# EasyEDA Pro project ProProject_ESP32-CAN_2024-07-06.epro

# Schematic can
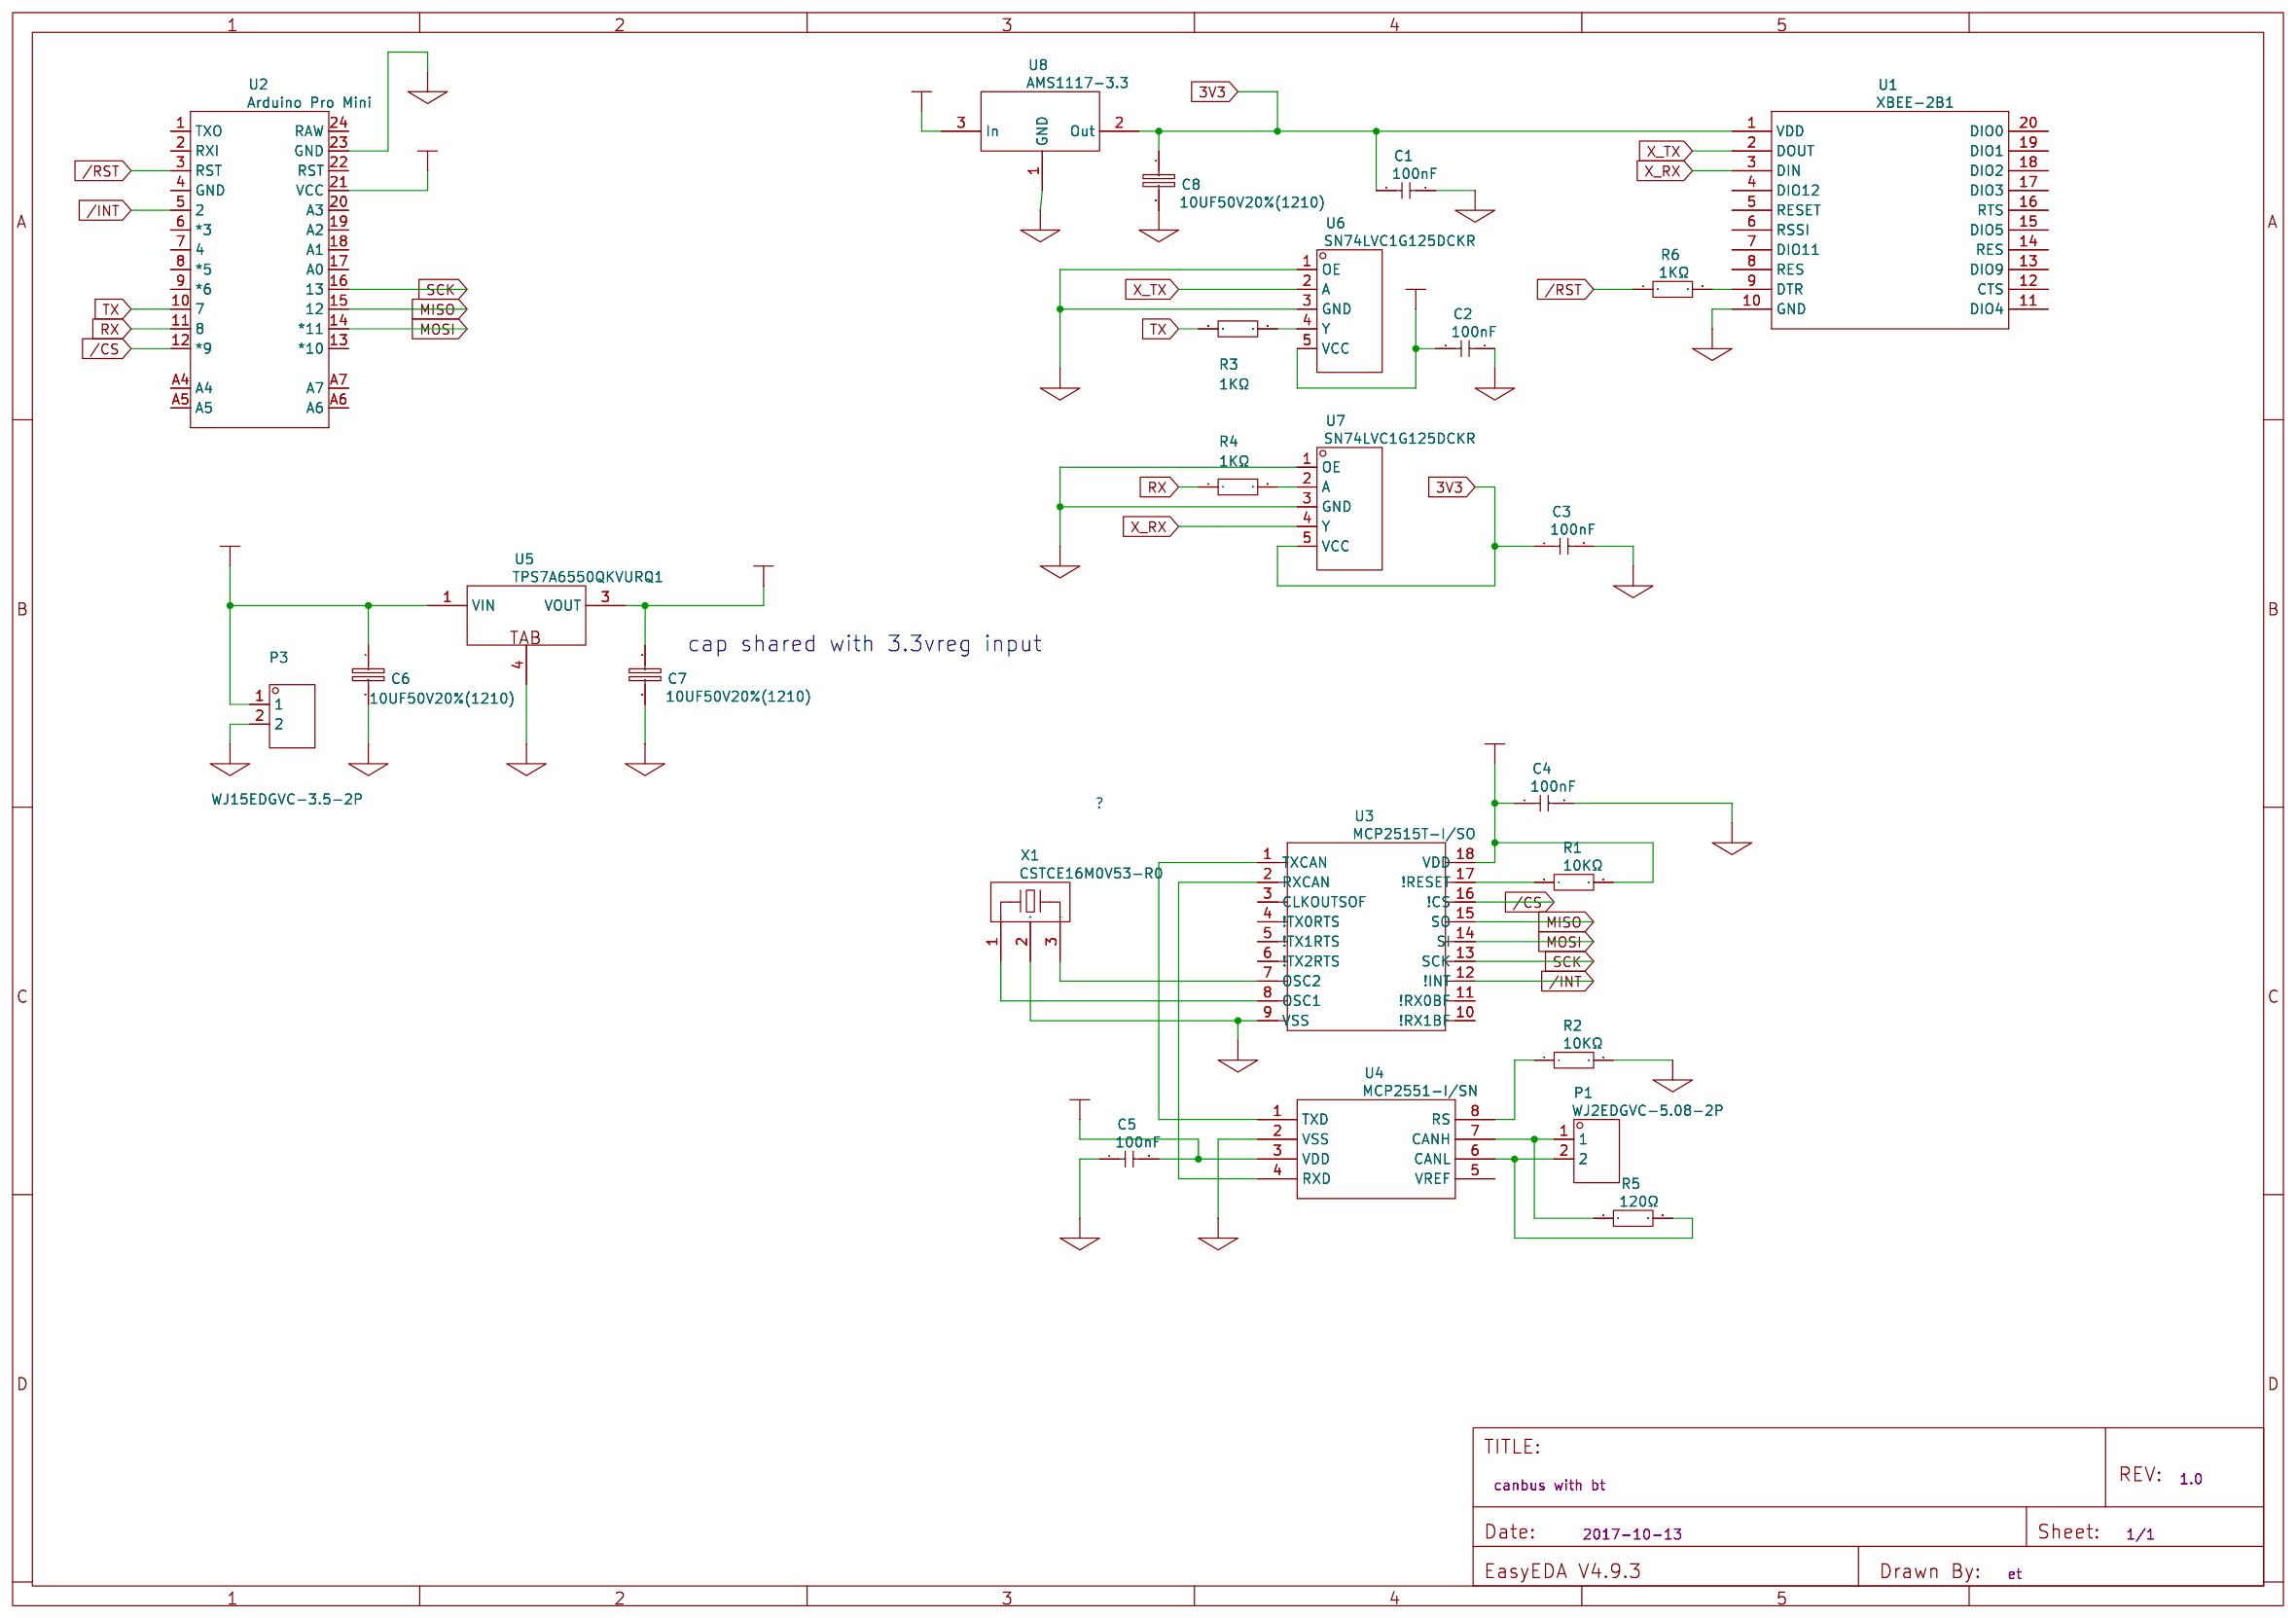
[diagram p0: schematic sheet]

## Parts
C1  100nF
C2  100nF
C3  100nF
C4  100nF
C5  100nF
C6  10UF50V20%(1210)
C7  10UF50V20%(1210)
C8  10UF50V20%(1210)
P1  WJ2EDGVC-5.08-2P
P3  WJ15EDGVC-3.5-2P
R1  10KΩ
R2  10KΩ
R3  1KΩ
R4  1KΩ
R5  120Ω
R6  1KΩ
U1  XBEE-2B1
U2  Arduino Pro Mini
U3  MCP2515T-I/SO
U4  MCP2551-I/SN
U5  TPS7A6550QKVURQ1
U6  SN74LVC1G125DCKR
U7  SN74LVC1G125DCKR
U8  AMS1117-3.3
X1  CSTCE16M0V53-R0

## Library data of the parts
C1-C5 = 100nF: SMD CAP Ceramic 100nF-50V-10%-X7R; Manufacturer Part: CC0603KRX7R9BB104
C6-C8 = 10UF50V20%(1210): Manufacturer Part: ?
P1 = WJ2EDGVC-5.08-2P: Supplier: LCSC; Manufacturer: ReliaPro; Supplier Part: C8445
P3 = WJ15EDGVC-3.5-2P: Supplier: LCSC; Manufacturer: ReliaPro; Manufacturer Part: WJ15EDGVC-3.5MM-2Pneedle; Supplier Part: C42700
R1 R2 = 10KΩ: Power: 1/10W; Tolerance: ±5%; Supplier: LCSC; Manufacturer: UniOhm; Manufacturer Part: 0603WAJ0103T5E; Supplier Part: C15401
R3 R4 R6 = 1KΩ: Power: 1/10W; Tolerance: ±0.1%; Supplier: LCSC; Manufacturer Part: TC0325B1001T5E; Manufacturer: UniOhm; Supplier Part: C54019
R5 = 120Ω: Power: 1/10W; Tolerance: ±1%; Supplier: LCSC; Manufacturer: UniOhm; Manufacturer Part: 0603WAF1200T5E; Supplier Part: C22787
U1 = XBEE-2B1: Xbee module footprints; Manufacturer Part: ?
U2 = Arduino Pro Mini: Manufacturer Part: ?
U3 = MCP2515T-I/SO: SMD IC Interface;
U4 = MCP2551-I/SN: SMD IC Interface
U5 = TPS7A6550QKVURQ1: Single Output Automotive LDO, 300 mA, Fixed 5 V Output, 4 to 40 V Input, 3-pin PFM (KVU), -40 to 125 degC, Green (RoHS  no SbBr); Manufacturer Part: ?
U6 U7 = SN74LVC1G125DCKR: Supplier: LCSC; Manufacturer: TI; Supplier Part: C7833
U8 = AMS1117-3.3: Supplier: LCSC; Manufacturer: AMS; Supplier Part: C6186
X1 = CSTCE16M0V53-R0: Supplier: LCSC; Manufacturer: muRata; Supplier Part: C32180

## Nets
3V3: C1.1 C3.1 C8.1 U1.1(VDD) U7.5(VCC) U8.2(Out)
+5V: C2.1 C4.1 C5.2 C7.1 R1.2 U2.21(VCC) U3.18(VDD) U4.3(VDD) U5.3(VOUT) U6.5(VCC) U8.3(In)
GND: C1.2 C2.2 C3.2 C4.2 C5.1 C6.2 C7.2 C8.2 P3.2 R2.2 U1.10(GND) U2.23(GND) U3.9(VSS) U4.2(VSS) U5.4(TAB) U6.1(OE) U6.3(GND) U7.1(OE) U7.3(GND) U8.1(GND) X1.2
VCC: C6.1 P3.1 U5.1(VIN)
/CS: U2.12(*9) U3.16(!CS)
/INT: U2.5(2) U3.12(!INT)
/RST: R6.1 U2.3(RST)
MISO: U2.15(12) U3.15(SO)
MOSI: U2.14(*11) U3.14(SI)
RX: R4.1 U2.11(8)
SCK: U2.16(13) U3.13(SCK)
TX: R3.1 U2.10(7)
X_RX: U1.3(DIN) U7.4(Y)
X_TX: U1.2(DOUT) U6.2(A)
Net-(P1-1): P1.1 R5.1 U4.7(CANH)
Net-(P1-2): P1.2 R5.2 U4.6(CANL)
Net-(R1-1): R1.1 U3.17(!RESET)
Net-(R2-1): R2.1 U4.8(RS)
Net-(R3-2): R3.2 U6.4(Y)
Net-(R4-2): R4.2 U7.2(A)
Net-(R6-2): R6.2 U1.9(DTR)
Net-(U3-1): U3.1(TXCAN) U4.1(TXD)
Net-(U3-2): U3.2(RXCAN) U4.4(RXD)
Net-(U3-7): U3.7(OSC2) X1.3
Net-(U3-8): U3.8(OSC1) X1.1

Not connected (* = marked no-connect by the designer): U1 4(DIO12) 5(RESET) 6(RSSI) 7(DIO11) 8(RES) 11(DIO4) 12(CTS) 13(DIO9) 14(RES) 15(DIO5) 16(RTS) 17(DIO3) 18(DIO2) 19(DIO1) 20(DIO0); U2 1(TXO) 2(RXI) 4(GND) 6(*3) 7(4) 8(*5) 9(*6) 13(*10) 17(A0) 18(A1) 19(A2) 20(A3) 22(RST) 24(RAW) A4 A5 A6 A7; U3 3(CLKOUTSOF) 4(!TX0RTS) 5(!TX1RTS) 6(!TX2RTS) 10(!RX1BF) 11(!RX0BF); U4 5(VREF)

## Notes on the sheet
- cap shared with 3.3vreg input

# Schematic esp32 devkit v1 shield
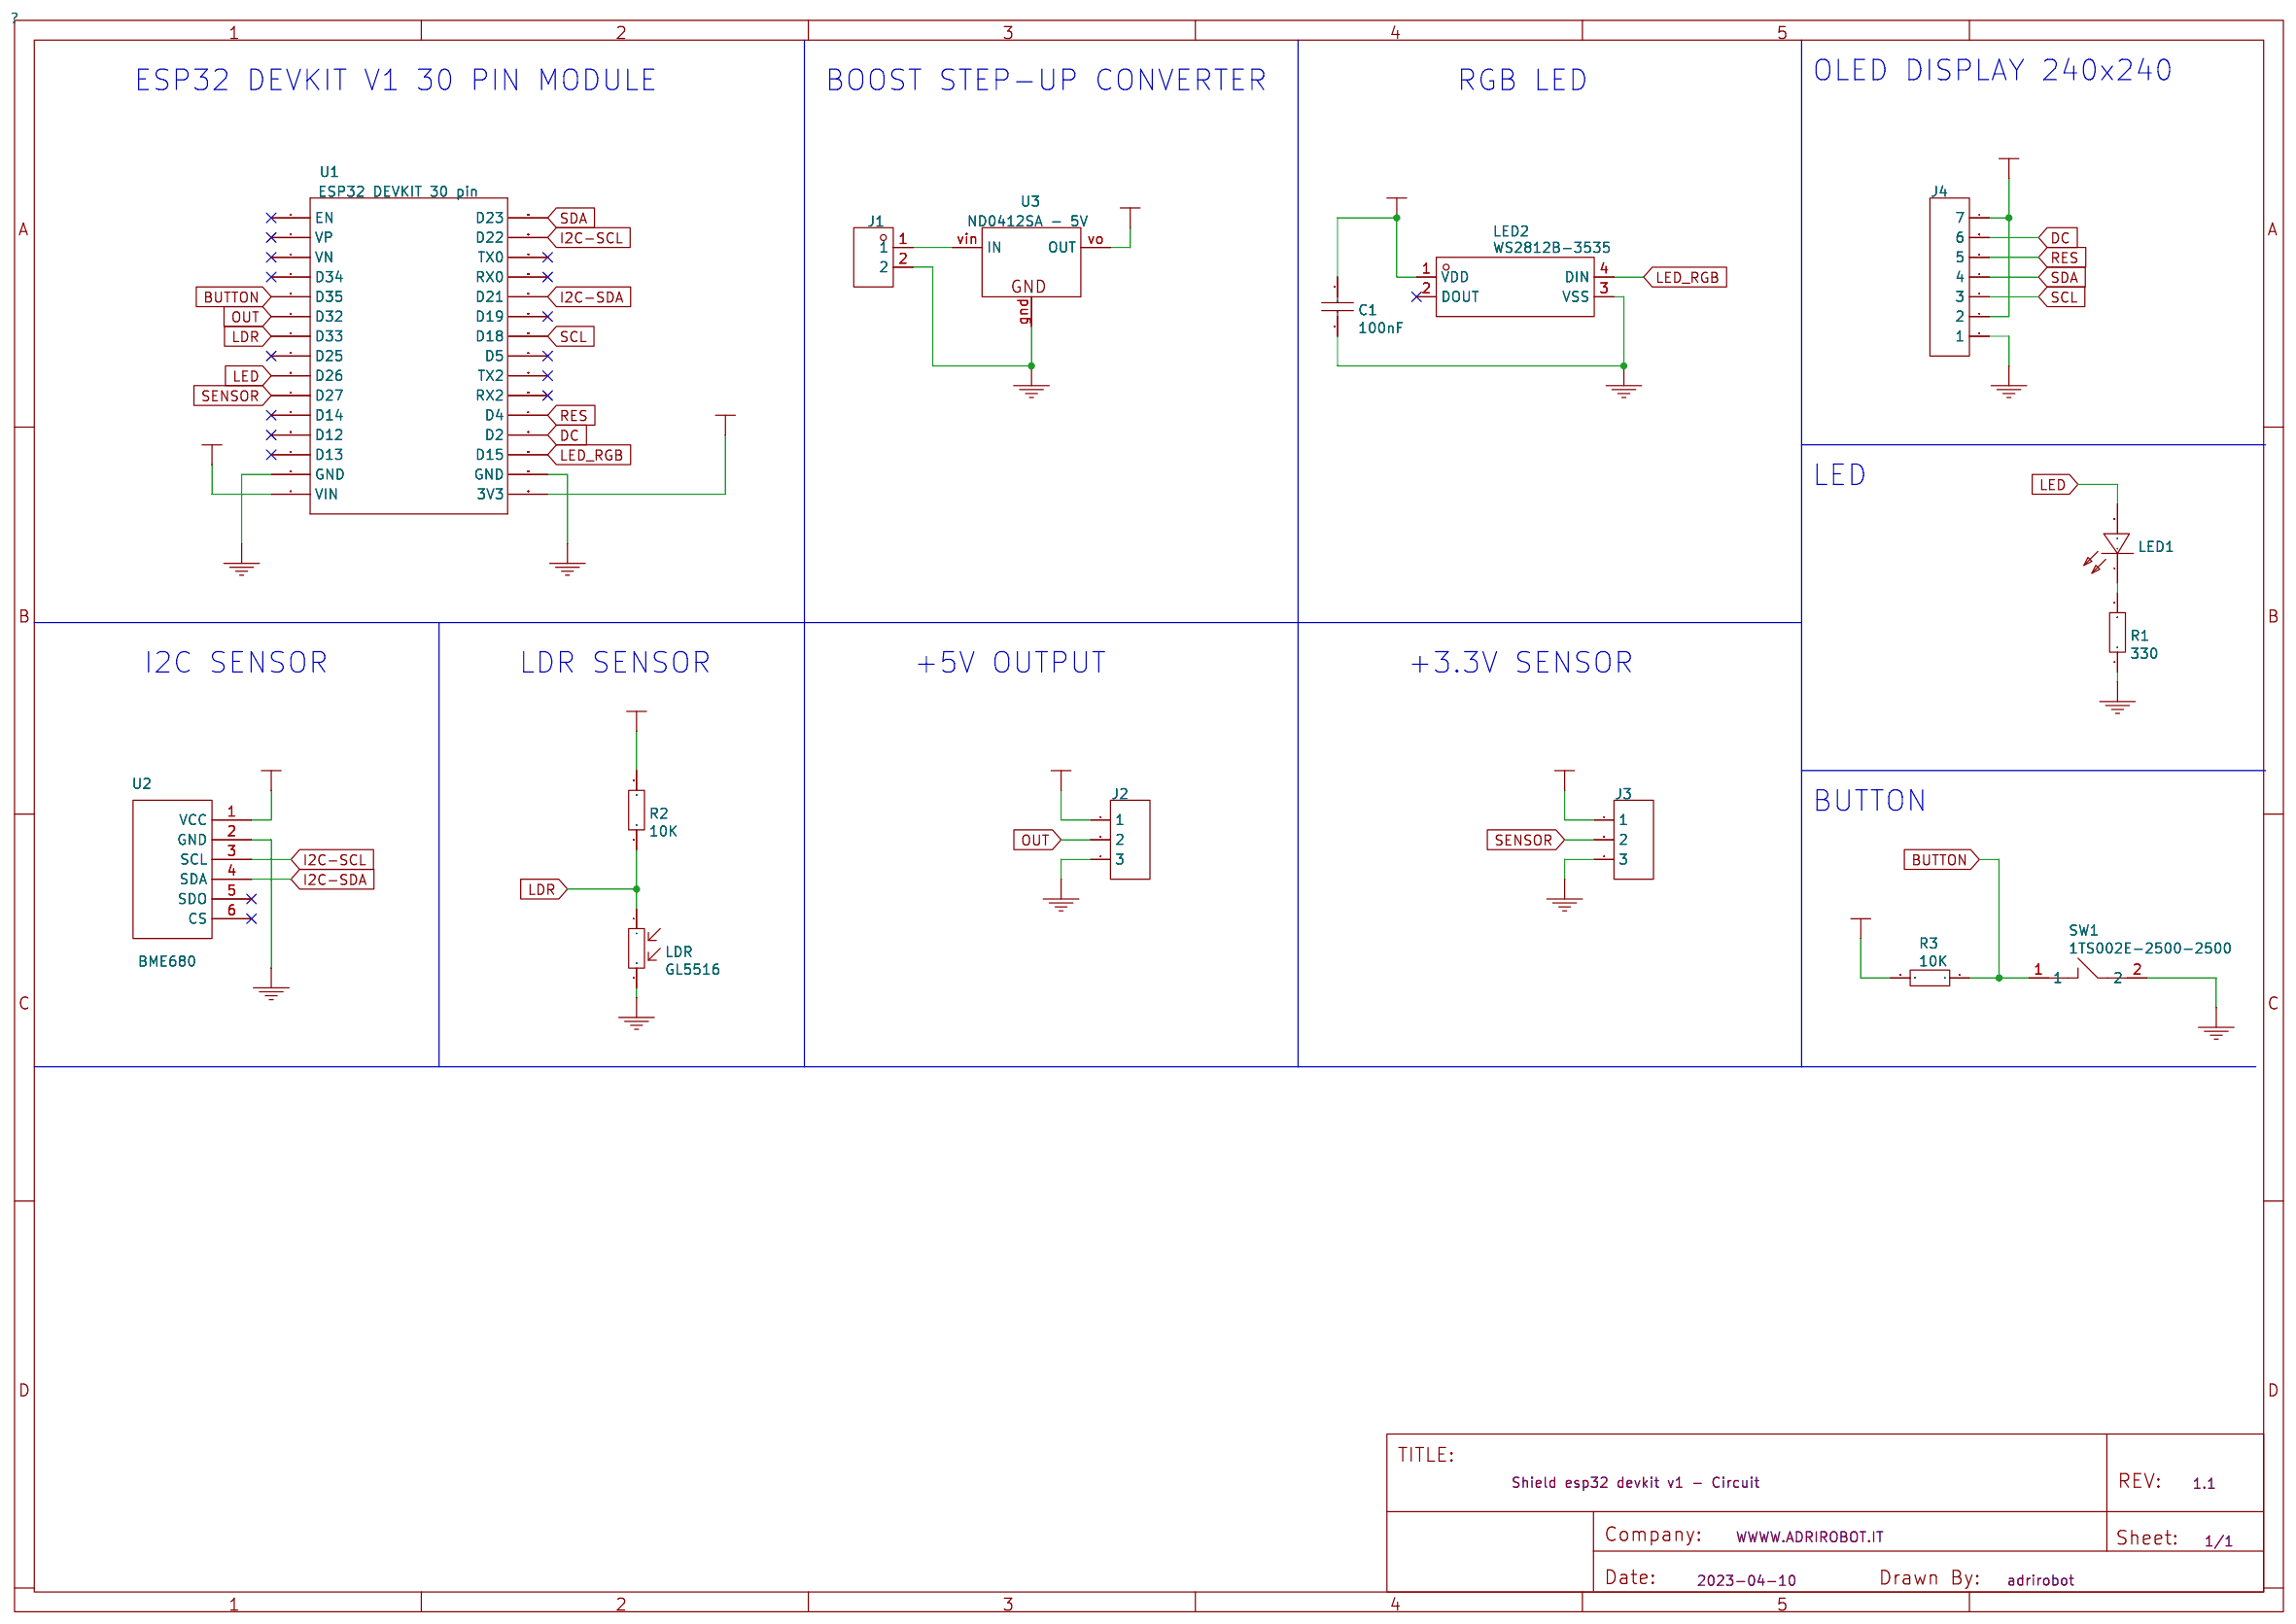
[diagram p1: schematic sheet]

## Parts
C1  100nF
J1  MTB125-1102R1
J2  Header-Female-2.54_1x3
J3  Header-Female-2.54_1x3
J4  CONN_01X07
LDR  GL5516
LED1  XL-0805QBC
LED2  WS2812B-3535
R1  330
R2  10K
R3  10K
SW1  1TS002E-2500-2500
U1  ESP32 DEVKIT 30 pin
U2  BME680
U3  ND0412SA - 5V

## Library data of the parts
C1 = 100nF: Supplier: LCSC; Manufacturer Part: CL21B104JBCNNNC; Manufacturer: SAMSUNG; Supplier Part: C62912; JLCPCB Part Class: Basic; JLCPCB SMD: Yes
J1 = MTB125-1102R1: Supplier: LCSC; Supplier Part: C376120; Manufacturer: MINTRON; JLCPCB Part Class: Extended Part
J2 J3 = Header-Female-2.54_1x3: Supplier Part: C225500; Supplier: LCSC; Manufacturer: Changjiang Connectors; Manufacturer Part: A2541HWV-3P; link: https://datasheet.lcsc.com/szlcsc/Boom-Precision-Elec-2-54mm-1-8P-Straight-Female-header_C27438.pdf; JLCPCB Part Class: Extended Part
J4 = CONN_01X07
LDR = GL5516: Supplier: LCSC; Manufacturer: 森霸; Supplier Part: C125626; JLCPCB Part Class: Extended Part
LED1 = XL-0805QBC: Supplier: LCSC; Manufacturer: EVERLIGHT; Manufacturer Part: 17-21SURC/S530-A3/TR8; Supplier Part: C72037; JLCPCB Part Class: Basic; JLCPCB SMD: Yes
LED2 = WS2812B-3535: Supplier: LCSC; Manufacturer: Worldsemi; Supplier Part: C114583; JLCPCB Part Class: Extend; JLCPCB SMD: Yes
R1 = 330: Supplier: LCSC; Supplier Part: C17630; Manufacturer: UniOhm; Manufacturer Part: 0805W8F3300T5E; JLCPCB Part Class: Extend; JLCPCB SMD: Yes
R2 R3 = 10K: Supplier: LCSC; Supplier Part: C17414; Manufacturer: UniOhm; Manufacturer Part: 0805W8F1002T5E; JLCPCB Part Class: Extend; JLCPCB SMD: Yes
SW1 = 1TS002E-2500-2500: Supplier: LCSC; Supplier Part: C329185; Manufacturer: HYP; JLCPCB Part Class: Extended Part
U1 = ESP32 DEVKIT 30 pin
U2 = BME680: Manufacturer Part: New SchematicLib
U3 = ND0412SA - 5V: Supplier Part: ND0412SA; Supplier: Pololu

## Nets
+3V3: J3.1 J4.2 J4.7 R2.2 R3.2 U1.3V3 U2.1(VCC)
+5V: C1.2 J2.1 LED2.1(VDD) U1.VIN U3.vo(OUT)
GND: C1.1 J1.2 J2.3 J3.3 J4.1 LDR.2 LED2.3(VSS) R1.1 SW1.2 U1.GND@1(GND) U1.GND@2(GND) U2.2(GND) U3.gnd(GND)
BUTTON: R3.1 SW1.1 U1.D35
DC: J4.6 U1.D2
I2C-SCL: U1.D22 U2.3(SCL)
I2C-SDA: U1.D21 U2.4(SDA)
LDR: LDR.1 R2.1 U1.D33
LED: LED1.2(A) U1.D26
LED_RGB: LED2.4(DIN) U1.D15
OUT: J2.2 U1.D32
RES: J4.5 U1.D4
SCL: J4.3 U1.D18
SDA: J4.4 U1.D23
SENSOR: J3.2 U1.D27
Net-(J1-1): J1.1 U3.vin(IN)
Net-(LED1-1): LED1.1(K) R1.2

Not connected (* = marked no-connect by the designer): LED2 2(DOUT)*; U1 D5* D12* D13* D14* D19* D25* D34* EN* RX0* RX2* TX0* TX2* VN* VP*; U2 5(SDO)* 6(CS)*

## Notes on the sheet
- ESP32 DEVKIT V1 30 PIN MODULE
- BOOST STEP-UP CONVERTER
- RGB LED
- OLED DISPLAY 240x240
- LED
- I2C SENSOR
- LDR SENSOR
- +5V OUTPUT
- +3.3V SENSOR
- BUTTON

# Schematic kd8116 v1
Create Date: 2024-02-29; Page Name: P1; Project Name: P1; Schematic Name: Schematic1; Update Date: 2024-02-29; Company: EasyEDA.com; Drawn: EasyEDA; Page Size: A4; Part Number: JLCPCB-002; Reviewed: EasyEDA; Version: V0.1
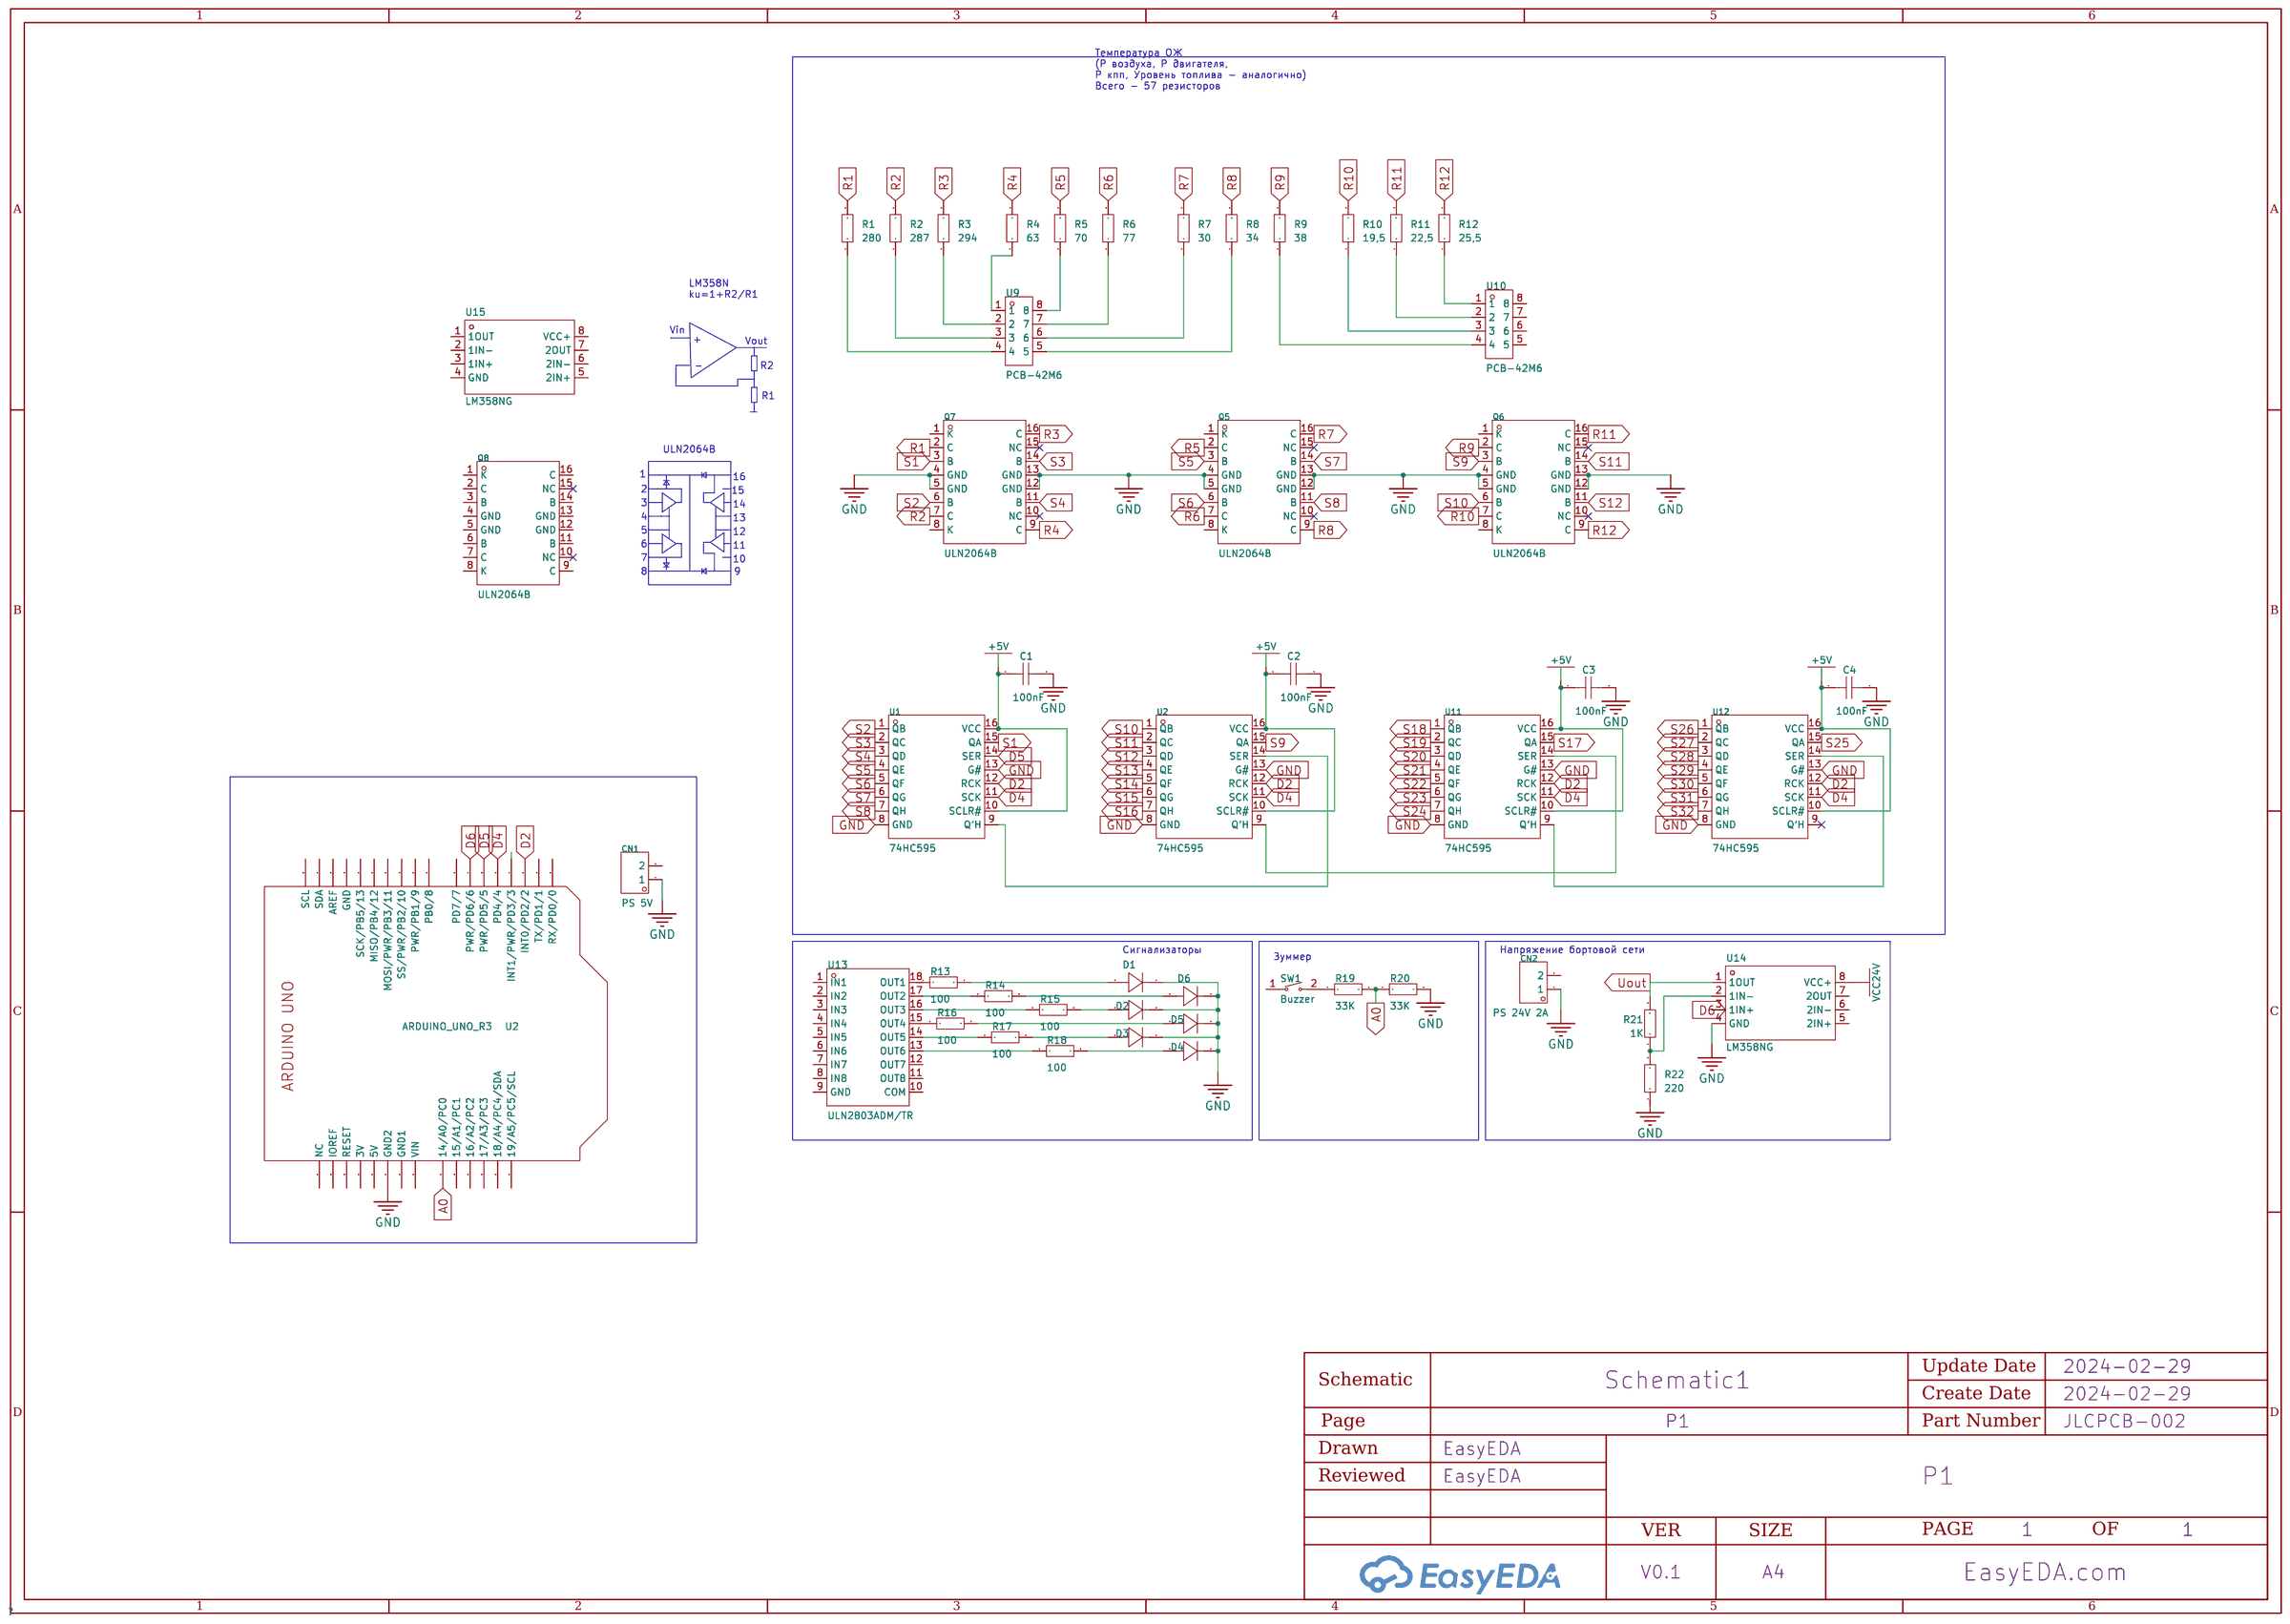
[diagram p2: schematic sheet]

## Parts
C1  100nF  [C0603]
C2  100nF  [C0603]
C3  100nF  [C0603]
C4  100nF  [C0603]
CN1  PS 5V  [CONN-TH_WJ2EDGVC-5.08-2P]
CN2  PS 24V 2A  [CONN-TH_WJ2EDGVC-5.08-2P]
D1  -  [DO-41_BD2.4-L4.7-P8.70-D0.9-RD]
D2  -  [DO-41_BD2.4-L4.7-P8.70-D0.9-RD]
D3  -  [DO-41_BD2.4-L4.7-P8.70-D0.9-RD]
D4  -  [DO-41_BD2.4-L4.7-P8.70-D0.9-RD]
D5  -  [DO-41_BD2.4-L4.7-P8.70-D0.9-RD]
D6  -  [DO-41_BD2.4-L4.7-P8.70-D0.9-RD]
Q5  ULN2064B  [PDIP-16_L22.1-W6.3-P2.54-LS7.6-BL]
Q6  ULN2064B  [PDIP-16_L22.1-W6.3-P2.54-LS7.6-BL]
Q7  ULN2064B  [PDIP-16_L22.1-W6.3-P2.54-LS7.6-BL]
Q8  ULN2064B  [PDIP-16_L22.1-W6.3-P2.54-LS7.6-BL]
R1  280  [R0603]
R2  287  [R0603]
R3  294  [R0603]
R4  63  [R0603]
R5  70  [R0603]
R6  77  [R0603]
R7  30  [R0603]
R8  34  [R0603]
R9  38  [R0603]
R10  19,5  [R0603]
R11  22,5  [R0603]
R12  25,5  [R0603]
R13  100  [R0603]
R14  100  [R0603]
R15  100  [R0603]
R16  100  [R0603]
R17  100  [R0603]
R18  100  [R0603]
R19  33K  [R0603]
R20  33K  [R0603]
R21  1K  [R0603]
R22  220  [R0603]
SW1  Buzzer  [KEY-SMD_L6.0-W3.5-LS8.0]
U1  74HC595  [SOP-16_L9.9-W3.9-P1.27-LS6.0-BL]
U2  ARDUINO_UNO_R3
U2#2  74HC595  [SOP-16_L9.9-W3.9-P1.27-LS6.0-BL]
U9  PCB-42M6  [TH_PCB-42M6]
U10  PCB-42M6  [TH_PCB-42M6]
U11  74HC595  [SOP-16_L9.9-W3.9-P1.27-LS6.0-BL]
U12  74HC595  [SOP-16_L9.9-W3.9-P1.27-LS6.0-BL]
U13  ULN2803ADM/TR  [SOP-18_L11.4-W7.6-P1.27-LS10.6-BL]
U14  LM358NG  [DIP-8_L10.1-W6.3-P2.54-LS7.6-BL]
U15  LM358NG  [DIP-8_L10.1-W6.3-P2.54-LS7.6-BL]

## Library data of the parts
C1-C4 = CAP_0603: Supplier Footprint: 0603
CN1 CN2 = WJ2EDGVC-5.08-2P: Connector Type:板端/Receptacle-Close Structure:1x2P Pitch:5.08mm Color:Green Mounting Style:直针 Number of Pins:2P Number of Rows:1 Number of PINs Per Row:2; LCSC Part Name: 5.08mm 1x2P 排数:1 每排P数:2; Supplier Part: C8445; Manufacturer: KANGNEX(康奈克斯电气); Supplier Footprint: 插件,P=5.08mm; JLCPCB Part Class: Extended Part; Datasheet: https://atta.szlcsc.com/upload/public/pdf/source/20191225/C8445_EB1D2D396D429FBA4C627FE17CC77AF0.pdf; Supplier: LCSC; Connector Type: 板端/Receptacle-Close; Structure: 1x2P; Pitch: 5.08mm; Color: Green; Mounting Style: 直针; Number of Pins: 2P; Number of Rows: 1; Number of PINs Per Row: 2
D1-D6 = 1N4007: Supplier Footprint: DO-41
Q5-Q8 = ULN2064B: Maximum collector Emitter Voltage (Vceo):50V Collector Current(Ic):1.75A; Supplier Part: C222080; Manufacturer: ST(意法半导体); Supplier Footprint: PowerDIP-16; JLCPCB Part Class: Extended Part; Datasheet: https://atta.szlcsc.com/upload/public/pdf/source/20180516/C222080_7A3C26329C276FCE285A80DD187C4CED.pdf; Supplier: LCSC; Maximum collector Emitter Voltage (Vceo): 50V; Collector Current(Ic): 1.75A
R1-R22 = Res_0603: Supplier Footprint: 0603
SW1 = BUTTON2,KEY: Supplier Part: C9900020455; Supplier: LCSC
U1 U2#2 U11 U12 = 74HC595: Function:串行至串行或并行 Supply Voltage:2V~6V Supply Voltage:2V~6V Number of Elements:1 Number of Bits per Element:8 Output Type:Tri-State Series: Operating Temperature:-40℃~+85℃ Operating Temperature:-40℃~+85℃; Supplier Part: C18164493; Manufacturer: GR(国睿); Supplier Footprint: SOP-16; Datasheet: https://atta.szlcsc.com/upload/public/pdf/source/20230915/F264A7C02E418D1689E15579DAA93EB8.pdf; Supplier: LCSC; Function: 串行至串行或并行; Supply Voltage: 2V~6V; Number of Elements: 1; Number of Bits per Element: 8; Output Type: Tri-State; Operating Temperature: -40℃~+85℃
U2 = ARDUINO_UNO_R3
U9 U10 = PCB-42M6螺母端子: Supplier Part: C9900020219; Supplier Footprint: PCB42; Supplier: LCSC
U13 = ULN2803ADM/TR: number of channels:八路; Supplier Part: C2683131; Manufacturer: HGSEMI(华冠); Supplier Footprint: SOP-18-300mil; JLCPCB Part Class: Extended Part; Datasheet: https://atta.szlcsc.com/upload/public/pdf/source/20231009/94AF2541D05EF3AF782C5D5776E3D68F.pdf; Supplier: LCSC; number of channels: 八路
U14 U15 = LM358NG: Number of Circuits:; Supplier Part: C7552; Supplier Footprint: DIP-8-300mil; JLCPCB Part Class: Extended Part; Supplier: LCSC

## Nets
+5V: C1.1 C2.1 C3.1 C4.1 U1.10(SCLR#) U1.16(VCC) U2#2.10(SCLR#) U2#2.16(VCC) U11.10(SCLR#) U11.16(VCC) U12.10(SCLR#) U12.16(VCC)
GND: C1.2 C2.2 C3.2 C4.2 CN1.1 CN2.1 D1.1(K) D2.1(K) D3.1(K) D4.1(K) D5.1(K) D6.1(K) Q5.4(GND) Q5.5(GND) Q5.12(GND) Q5.13(GND) Q6.4(GND) Q6.5(GND) Q6.12(GND) Q6.13(GND) Q7.4(GND) Q7.5(GND) Q7.12(GND) Q7.13(GND) R20.2 R22.1 U1.8(GND) U1.13(G#) U2.27(GND2) U2#2.8(GND) U2#2.13(G#) U11.8(GND) U11.13(G#) U12.8(GND) U12.13(G#) U14.4(GND)
VCC24V: U14.8(VCC+)
A0: R19.2 R20.1 U2.24(14/A0/PC0)
D2: U1.12(RCK) U2.3(INT0/PD2/2) U2#2.12(RCK) U11.12(RCK) U12.12(RCK)
D4: U1.11(SCK) U2.5(PD4/4) U2#2.11(SCK) U11.11(SCK) U12.11(SCK)
D5: U1.14(SER) U2.6(PWR/PD5/5)
D6: U2.7(PWR/PD6/6) U14.3(1IN+)
R1: Q7.2(C) R1.2
R2: Q7.7(C) R2.2
R3: Q7.16(C) R3.2
R4: Q7.9(C) R4.2
R5: Q5.2(C) R5.2
R6: Q5.7(C) R6.2
R7: Q5.16(C) R7.2
R8: Q5.9(C) R8.2
R9: Q6.2(C) R9.2
R10: Q6.7(C) R10.2
R11: Q6.16(C) R11.2
R12: Q6.9(C) R12.2
S1: Q7.3(B) U1.15(QA)
S2: Q7.6(B) U1.1(QB)
S3: Q7.14(B) U1.2(QC)
S4: Q7.11(B) U1.3(QD)
S5: Q5.3(B) U1.4(QE)
S6: Q5.6(B) U1.5(QF)
S7: Q5.14(B) U1.6(QG)
S8: Q5.11(B) U1.7(QH)
S9: Q6.3(B) U2#2.15(QA)
S10: Q6.6(B) U2#2.1(QB)
S11: Q6.14(B) U2#2.2(QC)
S12: Q6.11(B) U2#2.3(QD)
S13: U2#2.4(QE)
S14: U2#2.5(QF)
S15: U2#2.6(QG)
S16: U2#2.7(QH)
S17: U11.15(QA)
S18: U11.1(QB)
S19: U11.2(QC)
S20: U11.3(QD)
S21: U11.4(QE)
S22: U11.5(QF)
S23: U11.6(QG)
S24: U11.7(QH)
S25: U12.15(QA)
S26: U12.1(QB)
S27: U12.2(QC)
S28: U12.3(QD)
S29: U12.4(QE)
S30: U12.5(QF)
S31: U12.6(QG)
S32: U12.7(QH)
Uout: R21.2 U14.1(1OUT)
Net-(D1-2): D1.2(A) R13.2
Net-(D2-2): D2.2(A) R15.2
Net-(D3-2): D3.2(A) R17.2
Net-(D4-2): D4.2(A) R18.2
Net-(D5-2): D5.2(A) R16.2
Net-(D6-2): D6.2(A) R14.2
Net-(R1-1): R1.1 U9.4
Net-(R2-1): R2.1 U9.3
Net-(R3-1): R3.1 U9.2
Net-(R4-1): R4.1 U9.1
Net-(R5-1): R5.1 U9.8
Net-(R6-1): R6.1 U9.7
Net-(R7-1): R7.1 U9.6
Net-(R8-1): R8.1 U9.5
Net-(R9-1): R9.1 U10.4
Net-(R10-1): R10.1 U10.3
Net-(R11-1): R11.1 U10.2
Net-(R12-1): R12.1 U10.1
Net-(R13-1): R13.1 U13.18(OUT1)
Net-(R14-1): R14.1 U13.17(OUT2)
Net-(R15-1): R15.1 U13.16(OUT3)
Net-(R16-1): R16.1 U13.15(OUT4)
Net-(R17-1): R17.1 U13.14(OUT5)
Net-(R18-1): R18.1 U13.13(OUT6)
Net-(R19-1): R19.1 SW1.2
Net-(R21-1): R21.1 R22.2 U14.2(1IN-)
Net-(U1-9): U1.9(Q′H) U2#2.14(SER)
Net-(U2#2-9): U2#2.9(Q′H) U11.14(SER)
Net-(U11-9): U11.9(Q′H) U12.14(SER)

Not connected (* = marked no-connect by the designer): CN1 2; CN2 2; Q5 1(K) 8(K) 10(NC)* 15(NC)*; Q6 1(K) 8(K) 10(NC)* 15(NC)*; Q7 1(K) 8(K) 10(NC)* 15(NC)*; Q8 1(K) 2(C) 3(B) 4(GND) 5(GND) 6(B) 7(C) 8(K) 9(C) 10(NC)* 11(B) 12(GND) 13(GND) 14(B) 15(NC)* 16(C); SW1 1; U2 1(RX/PD0/0) 2(TX/PD1/1) 4(INT1/PWR/PD3/3) 8(PD7/7) 9(PB0/8) 10(PWR/PB1/9) 11(SS/PWR/PB2/10) 12(MOSI/PWR/PB3/11) 13(MISO/PB4/12) 14(SCK/PB5/13) 15(GND) 16(AREF) 17(SDA) 18(SCL) 19(19/A5/PC5/SCL) 20(18/A4/PC4/SDA) 21(17/A3/PC3) 22(16/A2/PC2) 23(15/A1/PC1) 25(VIN) 26(GND1) 28(5V) 29(3V) 30(RESET) 31(IOREF) 32(NC); U10 5 6 7 8; U12 9(Q′H)*; U13 1(IN1) 2(IN2) 3(IN3) 4(IN4) 5(IN5) 6(IN6) 7(IN7) 8(IN8) 9(GND) 10(COM) 11(OUT8) 12(OUT7); U14 5(2IN+) 6(2IN-) 7(2OUT); U15 1(1OUT) 2(1IN-) 3(1IN+) 4(GND) 5(2IN+) 6(2IN-) 7(2OUT) 8(VCC+)

## Notes on the sheet
- Температура ОЖ
  (P воздуха, P двигателя,
  P кпп, Уровень топлива - аналогично)
  Всего - 57 резисторов
- LM358N
  ku=1+R2/R1
- Vin
- +
- Vout
- -
- R2
- R1
- ULN2064B
- 1
- 16
- 2
- 15
- 3
- 14
- 4
- 13
- 5
- 12
- 6
- 7
- 10
- 11
- 8
- 9
- Сигнализаторы
- Зуммер
- Напряжение бортовой сети

# Schematic kd8116 v2
Create Date: 2024-04-18; Page Name: P1; Project Name: ESP32-CAN (1); Schematic Name: kd8116 v2; Update Date: 2024-04-18; Company: EasyEDA.com; Drawn: EasyEDA; Page Size: A4; Part Number: JLCPCB-002; Reviewed: EasyEDA; Version: V0.1
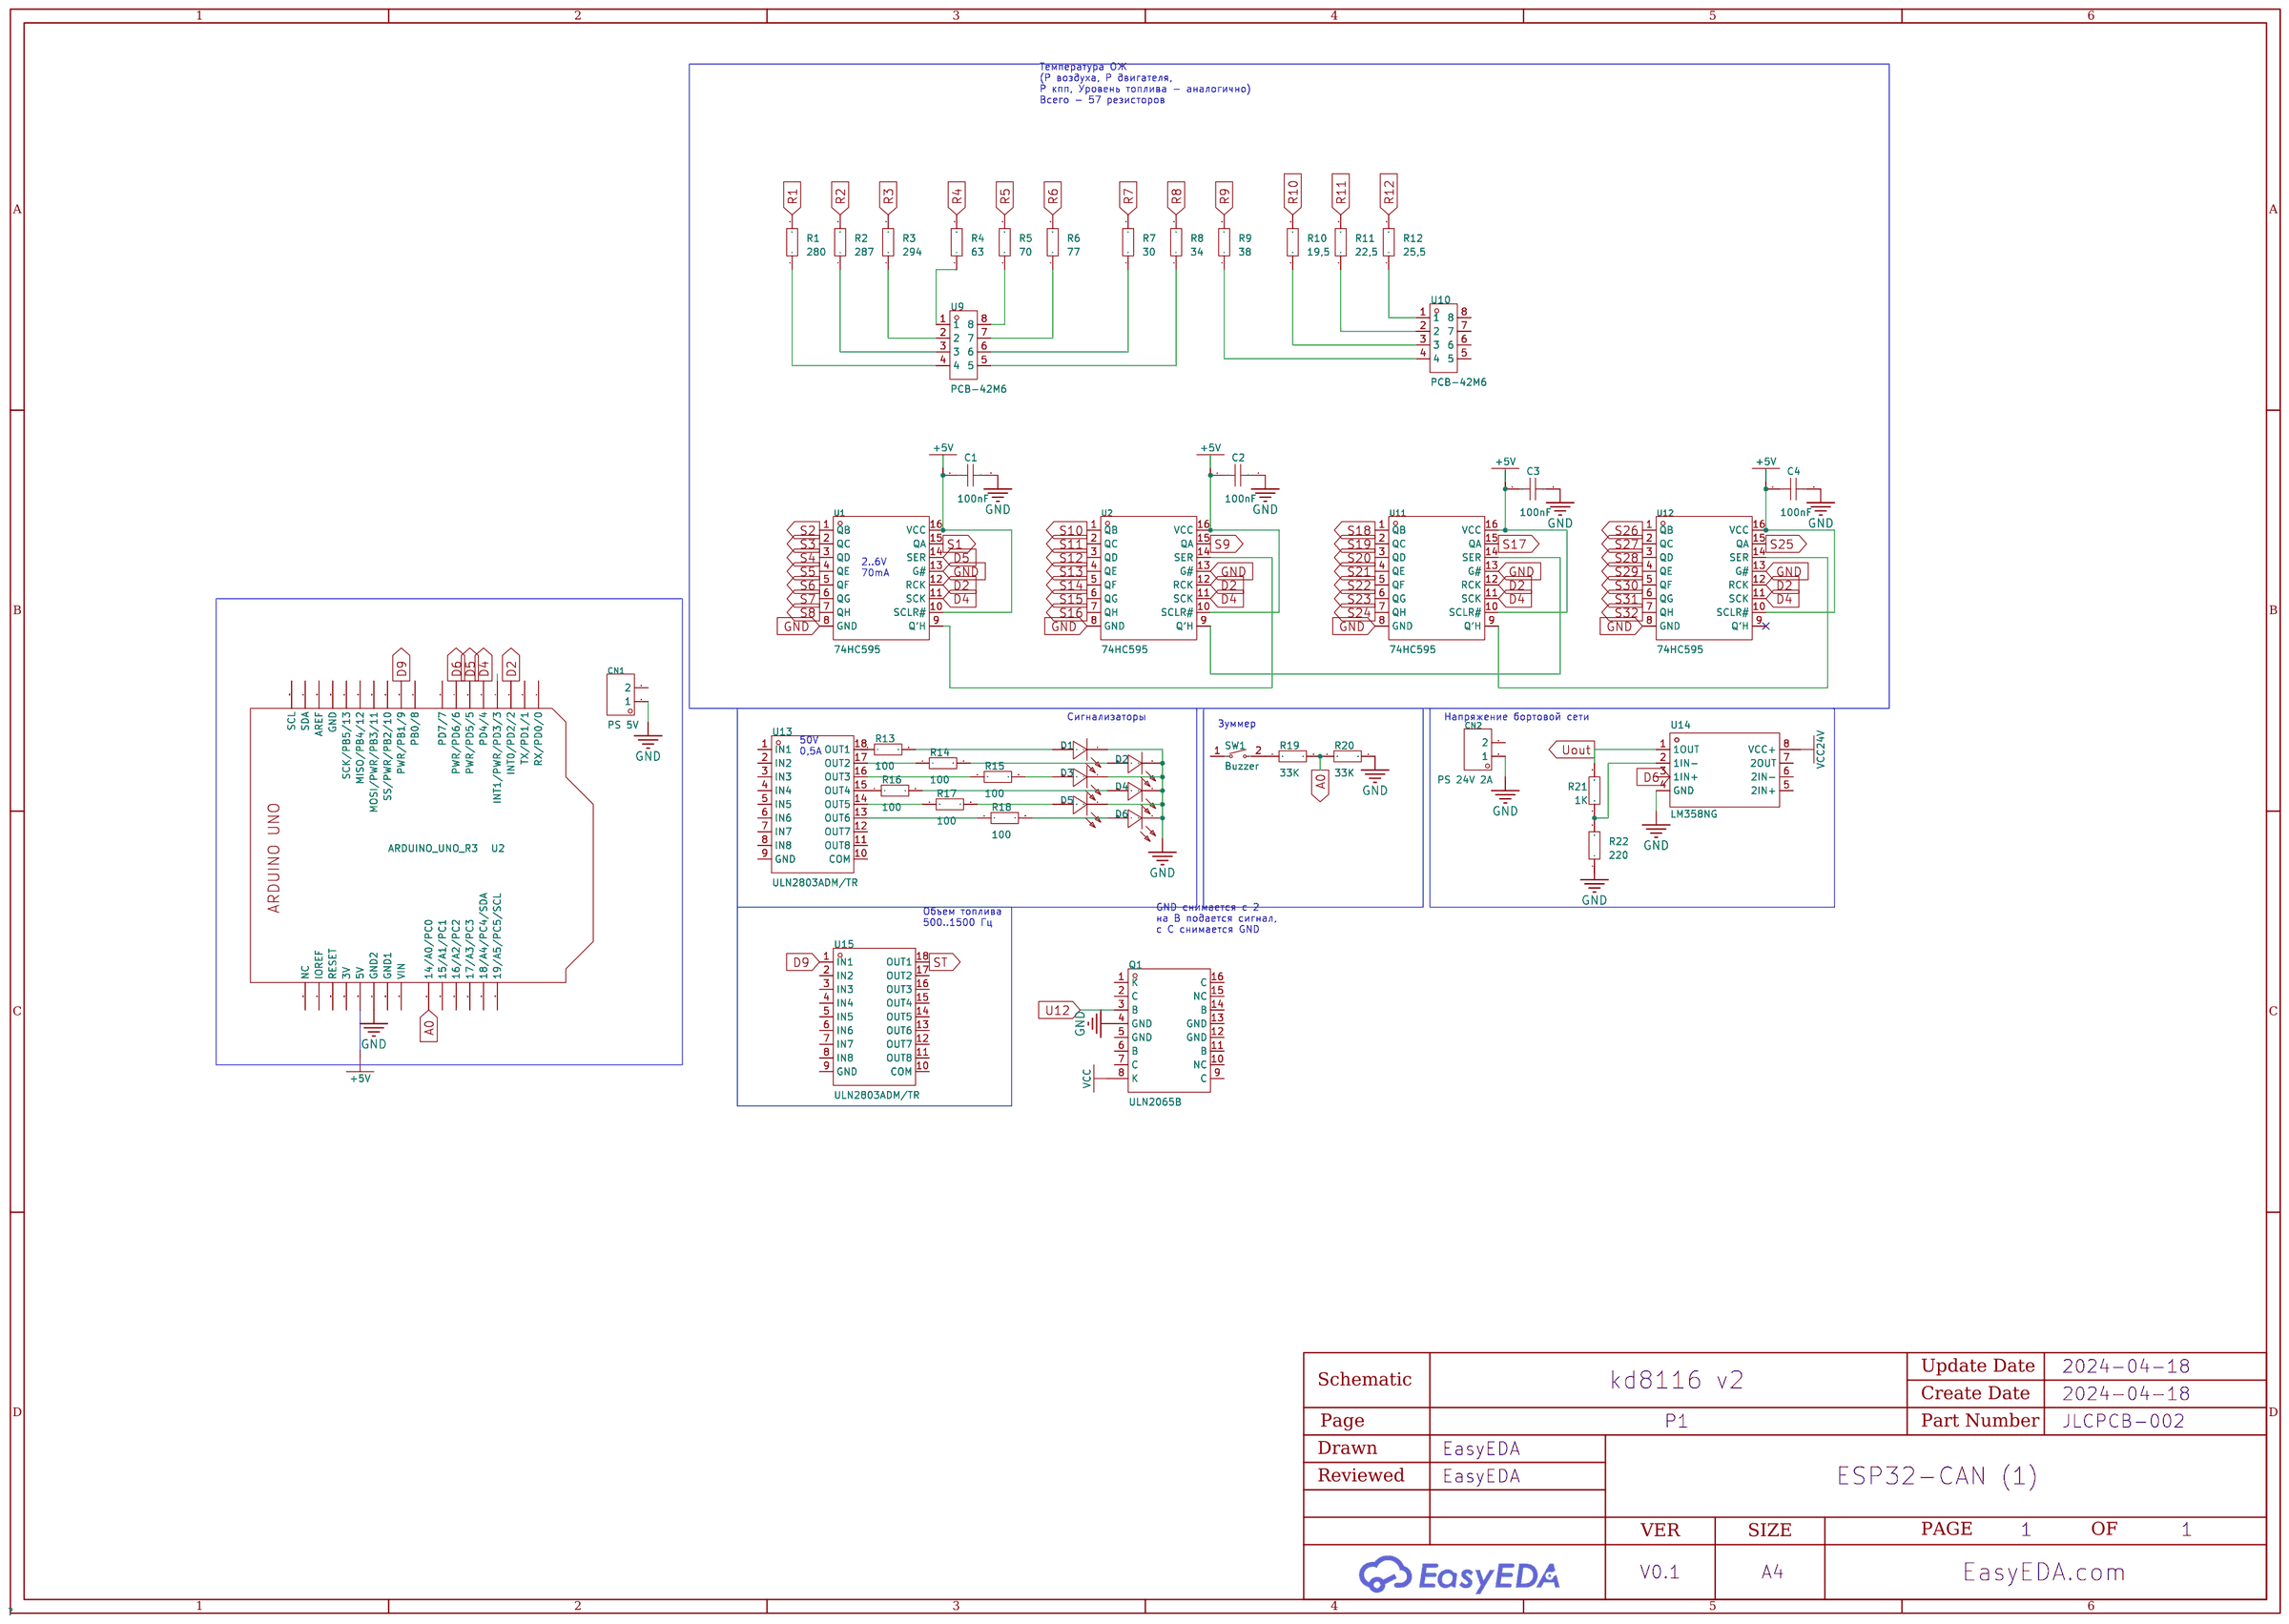
[diagram p3: schematic sheet]

## Parts
C1  100nF  [C0603]
C2  100nF  [C0603]
C3  100nF  [C0603]
C4  100nF  [C0603]
CN1  PS 5V  [CONN-TH_WJ2EDGVC-5.08-2P]
CN2  PS 24V 2A  [CONN-TH_WJ2EDGVC-5.08-2P]
D1  KT-0603R  [LED0603-RD]
D2  KT-0603R  [LED0603-RD]
D3  KT-0603R  [LED0603-RD]
D4  KT-0603R  [LED0603-RD]
D5  KT-0603R  [LED0603-RD]
D6  KT-0603R  [LED0603-RD]
Q1  ULN2065B  [CDIP-16_L19.9-W6.7-P2.54-LS7.6-BL]
R1  280  [R0603]
R2  287  [R0603]
R3  294  [R0603]
R4  63  [R0603]
R5  70  [R0603]
R6  77  [R0603]
R7  30  [R0603]
R8  34  [R0603]
R9  38  [R0603]
R10  19,5  [R0603]
R11  22,5  [R0603]
R12  25,5  [R0603]
R13  100  [R0603]
R14  100  [R0603]
R15  100  [R0603]
R16  100  [R0603]
R17  100  [R0603]
R18  100  [R0603]
R19  33K  [R0603]
R20  33K  [R0603]
R21  1K  [R0603]
R22  220  [R0603]
SW1  Buzzer  [KEY-SMD_L6.0-W3.5-LS8.0]
U1  74HC595  [SOP-16_L9.9-W3.9-P1.27-LS6.0-BL]
U2  ARDUINO_UNO_R3
U2#2  74HC595  [SOP-16_L9.9-W3.9-P1.27-LS6.0-BL]
U9  PCB-42M6  [TH_PCB-42M6]
U10  PCB-42M6  [TH_PCB-42M6]
U11  74HC595  [SOP-16_L9.9-W3.9-P1.27-LS6.0-BL]
U12  74HC595  [SOP-16_L9.9-W3.9-P1.27-LS6.0-BL]
U13  ULN2803ADM/TR  [SOP-18_L11.4-W7.6-P1.27-LS10.6-BL]
U14  LM358NG  [DIP-8_L10.1-W6.3-P2.54-LS7.6-BL]
U15  ULN2803ADM/TR  [SOP-18_L11.4-W7.6-P1.27-LS10.6-BL]

## Library data of the parts
C1-C4 = CAP_0603: Supplier Footprint: 0603
CN1 CN2 = WJ2EDGVC-5.08-2P: Connector Type:板端/Receptacle-Close Structure:1x2P Pitch:5.08mm Color:Green Mounting Style:直针 Number of Pins:2P Number of Rows:1 Number of PINs Per Row:2; LCSC Part Name: 5.08mm 1x2P 排数:1 每排P数:2; Supplier Part: C8445; Manufacturer: KANGNEX(康奈克斯电气); Supplier Footprint: 插件,P=5.08mm; JLCPCB Part Class: Extended Part; Datasheet: https://atta.szlcsc.com/upload/public/pdf/source/20191225/C8445_EB1D2D396D429FBA4C627FE17CC77AF0.pdf; Supplier: LCSC; Connector Type: 板端/Receptacle-Close; Structure: 1x2P; Pitch: 5.08mm; Color: Green; Mounting Style: 直针; Number of Pins: 2P; Number of Rows: 1; Number of PINs Per Row: 2
D1-D6 = KT-0603R: Emitted Color:Red Power Dissipation:- Forward Current:- Dominant Wavelength:- Dominant Wavelength:- Peak Wavelength:- Diode Configuration:- Lens Color:- Color Temperature:- Color Temperature:- Viewing Angle:- Mounting Sytle:- Operating Temperature:-40℃~+8; LCSC Part Name: 0603 红灯 高亮; Supplier Part: C2286; Manufacturer: KENTO; Supplier Footprint: 0603; JLCPCB Part Class: Basic Part; Datasheet: https://atta.szlcsc.com/upload/public/pdf/source/20160616/1466072038404.pdf; Supplier: LCSC; Emitted Color: Red; Operating Temperature: -40℃~+85℃
Q1 = ULN2065B: Supplier Part: C262995; Manufacturer: ST(意法半导体); Supplier Footprint: PowerDIP-16; JLCPCB Part Class: Extended Part; Datasheet: https://atta.szlcsc.com/upload/public/pdf/source/20180806/C262995_FC6CD29858464EEA4876994CE5C29E1A.pdf; Supplier: LCSC
R1-R22 = Res_0603: Supplier Footprint: 0603
SW1 = BUTTON2,KEY: Supplier Part: C9900020455; Supplier: LCSC
U1 U2#2 U11 U12 = 74HC595: Function:串行至串行或并行 Supply Voltage:2V~6V Supply Voltage:2V~6V Number of Elements:1 Number of Bits per Element:8 Output Type:Tri-State Series: Operating Temperature:-40℃~+85℃ Operating Temperature:-40℃~+85℃; Supplier Part: C18164493; Manufacturer: GR(国睿); Supplier Footprint: SOP-16; Datasheet: https://atta.szlcsc.com/upload/public/pdf/source/20230915/F264A7C02E418D1689E15579DAA93EB8.pdf; Supplier: LCSC; Function: 串行至串行或并行; Supply Voltage: 2V~6V; Number of Elements: 1; Number of Bits per Element: 8; Output Type: Tri-State; Operating Temperature: -40℃~+85℃
U2 = ARDUINO_UNO_R3
U9 U10 = PCB-42M6螺母端子: Supplier Part: C9900020219; Supplier Footprint: PCB42; Supplier: LCSC
U13 U15 = ULN2803ADM/TR: number of channels:八路; Supplier Part: C2683131; Manufacturer: HGSEMI(华冠); Supplier Footprint: SOP-18-300mil; JLCPCB Part Class: Extended Part; Datasheet: https://atta.szlcsc.com/upload/public/pdf/source/20231009/94AF2541D05EF3AF782C5D5776E3D68F.pdf; Supplier: LCSC; number of channels: 八路
U14 = LM358NG: Number of Circuits:; Supplier Part: C7552; Supplier Footprint: DIP-8-300mil; JLCPCB Part Class: Extended Part; Supplier: LCSC

## Nets
+5V: C1.1 C2.1 C3.1 C4.1 U1.10(SCLR#) U1.16(VCC) U2#2.10(SCLR#) U2#2.16(VCC) U11.10(SCLR#) U11.16(VCC) U12.10(SCLR#) U12.16(VCC)
GND: C1.2 C2.2 C3.2 C4.2 CN1.1 CN2.1 D1.1(K) D2.1(K) D3.1(K) D4.1(K) D5.1(K) D6.1(K) Q1.4(GND) R20.2 R22.1 U1.8(GND) U1.13(G#) U2.27(GND2) U2#2.8(GND) U2#2.13(G#) U11.8(GND) U11.13(G#) U12.8(GND) U12.13(G#) U14.4(GND)
VCC: Q1.8(K)
VCC24V: U14.8(VCC+)
A0: R19.2 R20.1 U2.24(14/A0/PC0)
D2: U1.12(RCK) U2.3(INT0/PD2/2) U2#2.12(RCK) U11.12(RCK) U12.12(RCK)
D4: U1.11(SCK) U2.5(PD4/4) U2#2.11(SCK) U11.11(SCK) U12.11(SCK)
D5: U1.14(SER) U2.6(PWR/PD5/5)
D6: U2.7(PWR/PD6/6) U14.3(1IN+)
D9: U2.10(PWR/PB1/9) U15.1(IN1)
R1: R1.2
R2: R2.2
R3: R3.2
R4: R4.2
R5: R5.2
R6: R6.2
R7: R7.2
R8: R8.2
R9: R9.2
R10: R10.2
R11: R11.2
R12: R12.2
S1: U1.15(QA)
S2: U1.1(QB)
S3: U1.2(QC)
S4: U1.3(QD)
S5: U1.4(QE)
S6: U1.5(QF)
S7: U1.6(QG)
S8: U1.7(QH)
S9: U2#2.15(QA)
S10: U2#2.1(QB)
S11: U2#2.2(QC)
S12: U2#2.3(QD)
S13: U2#2.4(QE)
S14: U2#2.5(QF)
S15: U2#2.6(QG)
S16: U2#2.7(QH)
S17: U11.15(QA)
S18: U11.1(QB)
S19: U11.2(QC)
S20: U11.3(QD)
S21: U11.4(QE)
S22: U11.5(QF)
S23: U11.6(QG)
S24: U11.7(QH)
S25: U12.15(QA)
S26: U12.1(QB)
S27: U12.2(QC)
S28: U12.3(QD)
S29: U12.4(QE)
S30: U12.5(QF)
S31: U12.6(QG)
S32: U12.7(QH)
ST: U15.18(OUT1)
U12: Q1.3(B)
Uout: R21.2 U14.1(1OUT)
Net-(D1-2): D1.2(A) R13.2
Net-(D2-2): D2.2(A) R14.2
Net-(D3-2): D3.2(A) R15.2
Net-(D4-2): D4.2(A) R16.2
Net-(D5-2): D5.2(A) R17.2
Net-(D6-2): D6.2(A) R18.2
Net-(R1-1): R1.1 U9.4
Net-(R2-1): R2.1 U9.3
Net-(R3-1): R3.1 U9.2
Net-(R4-1): R4.1 U9.1
Net-(R5-1): R5.1 U9.8
Net-(R6-1): R6.1 U9.7
Net-(R7-1): R7.1 U9.6
Net-(R8-1): R8.1 U9.5
Net-(R9-1): R9.1 U10.4
Net-(R10-1): R10.1 U10.3
Net-(R11-1): R11.1 U10.2
Net-(R12-1): R12.1 U10.1
Net-(R13-1): R13.1 U13.18(OUT1)
Net-(R14-1): R14.1 U13.17(OUT2)
Net-(R15-1): R15.1 U13.16(OUT3)
Net-(R16-1): R16.1 U13.15(OUT4)
Net-(R17-1): R17.1 U13.14(OUT5)
Net-(R18-1): R18.1 U13.13(OUT6)
Net-(R19-1): R19.1 SW1.2
Net-(R21-1): R21.1 R22.2 U14.2(1IN-)
Net-(U1-9): U1.9(Q′H) U2#2.14(SER)
Net-(U2#2-9): U2#2.9(Q′H) U11.14(SER)
Net-(U11-9): U11.9(Q′H) U12.14(SER)

Not connected (* = marked no-connect by the designer): CN1 2; CN2 2; Q1 1(K) 2(C) 5(GND) 6(B) 7(C) 9(C) 10(NC) 11(B) 12(GND) 13(GND) 14(B) 15(NC) 16(C); SW1 1; U2 1(RX/PD0/0) 2(TX/PD1/1) 4(INT1/PWR/PD3/3) 8(PD7/7) 9(PB0/8) 11(SS/PWR/PB2/10) 12(MOSI/PWR/PB3/11) 13(MISO/PB4/12) 14(SCK/PB5/13) 15(GND) 16(AREF) 17(SDA) 18(SCL) 19(19/A5/PC5/SCL) 20(18/A4/PC4/SDA) 21(17/A3/PC3) 22(16/A2/PC2) 23(15/A1/PC1) 25(VIN) 26(GND1) 28(5V) 29(3V) 30(RESET) 31(IOREF) 32(NC); U10 5 6 7 8; U12 9(Q′H)*; U13 1(IN1) 2(IN2) 3(IN3) 4(IN4) 5(IN5) 6(IN6) 7(IN7) 8(IN8) 9(GND) 10(COM) 11(OUT8) 12(OUT7); U14 5(2IN+) 6(2IN-) 7(2OUT); U15 2(IN2) 3(IN3) 4(IN4) 5(IN5) 6(IN6) 7(IN7) 8(IN8) 9(GND) 10(COM) 11(OUT8) 12(OUT7) 13(OUT6) 14(OUT5) 15(OUT4) 16(OUT3) 17(OUT2)

## Notes on the sheet
- Температура ОЖ
  (P воздуха, P двигателя,
  P кпп, Уровень топлива - аналогично)
  Всего - 57 резисторов
- 2..6V
  70mA
- Сигнализаторы
- Зуммер
- Напряжение бортовой сети
- 50V
  0,5A
- Объем топлива
  500..1500 Гц
- GND снимается с 2
  на B подается сигнал,
  с С снимается GND

# Schematic pp8180
Create Date: 2024-03-05; Page Name: P1; Project Name: P1; Schematic Name: PP8180; Update Date: 2024-03-05; Company: EasyEDA.com; Drawn: EasyEDA; Page Size: A4; Part Number: JLCPCB-002; Reviewed: EasyEDA; Version: V0.1
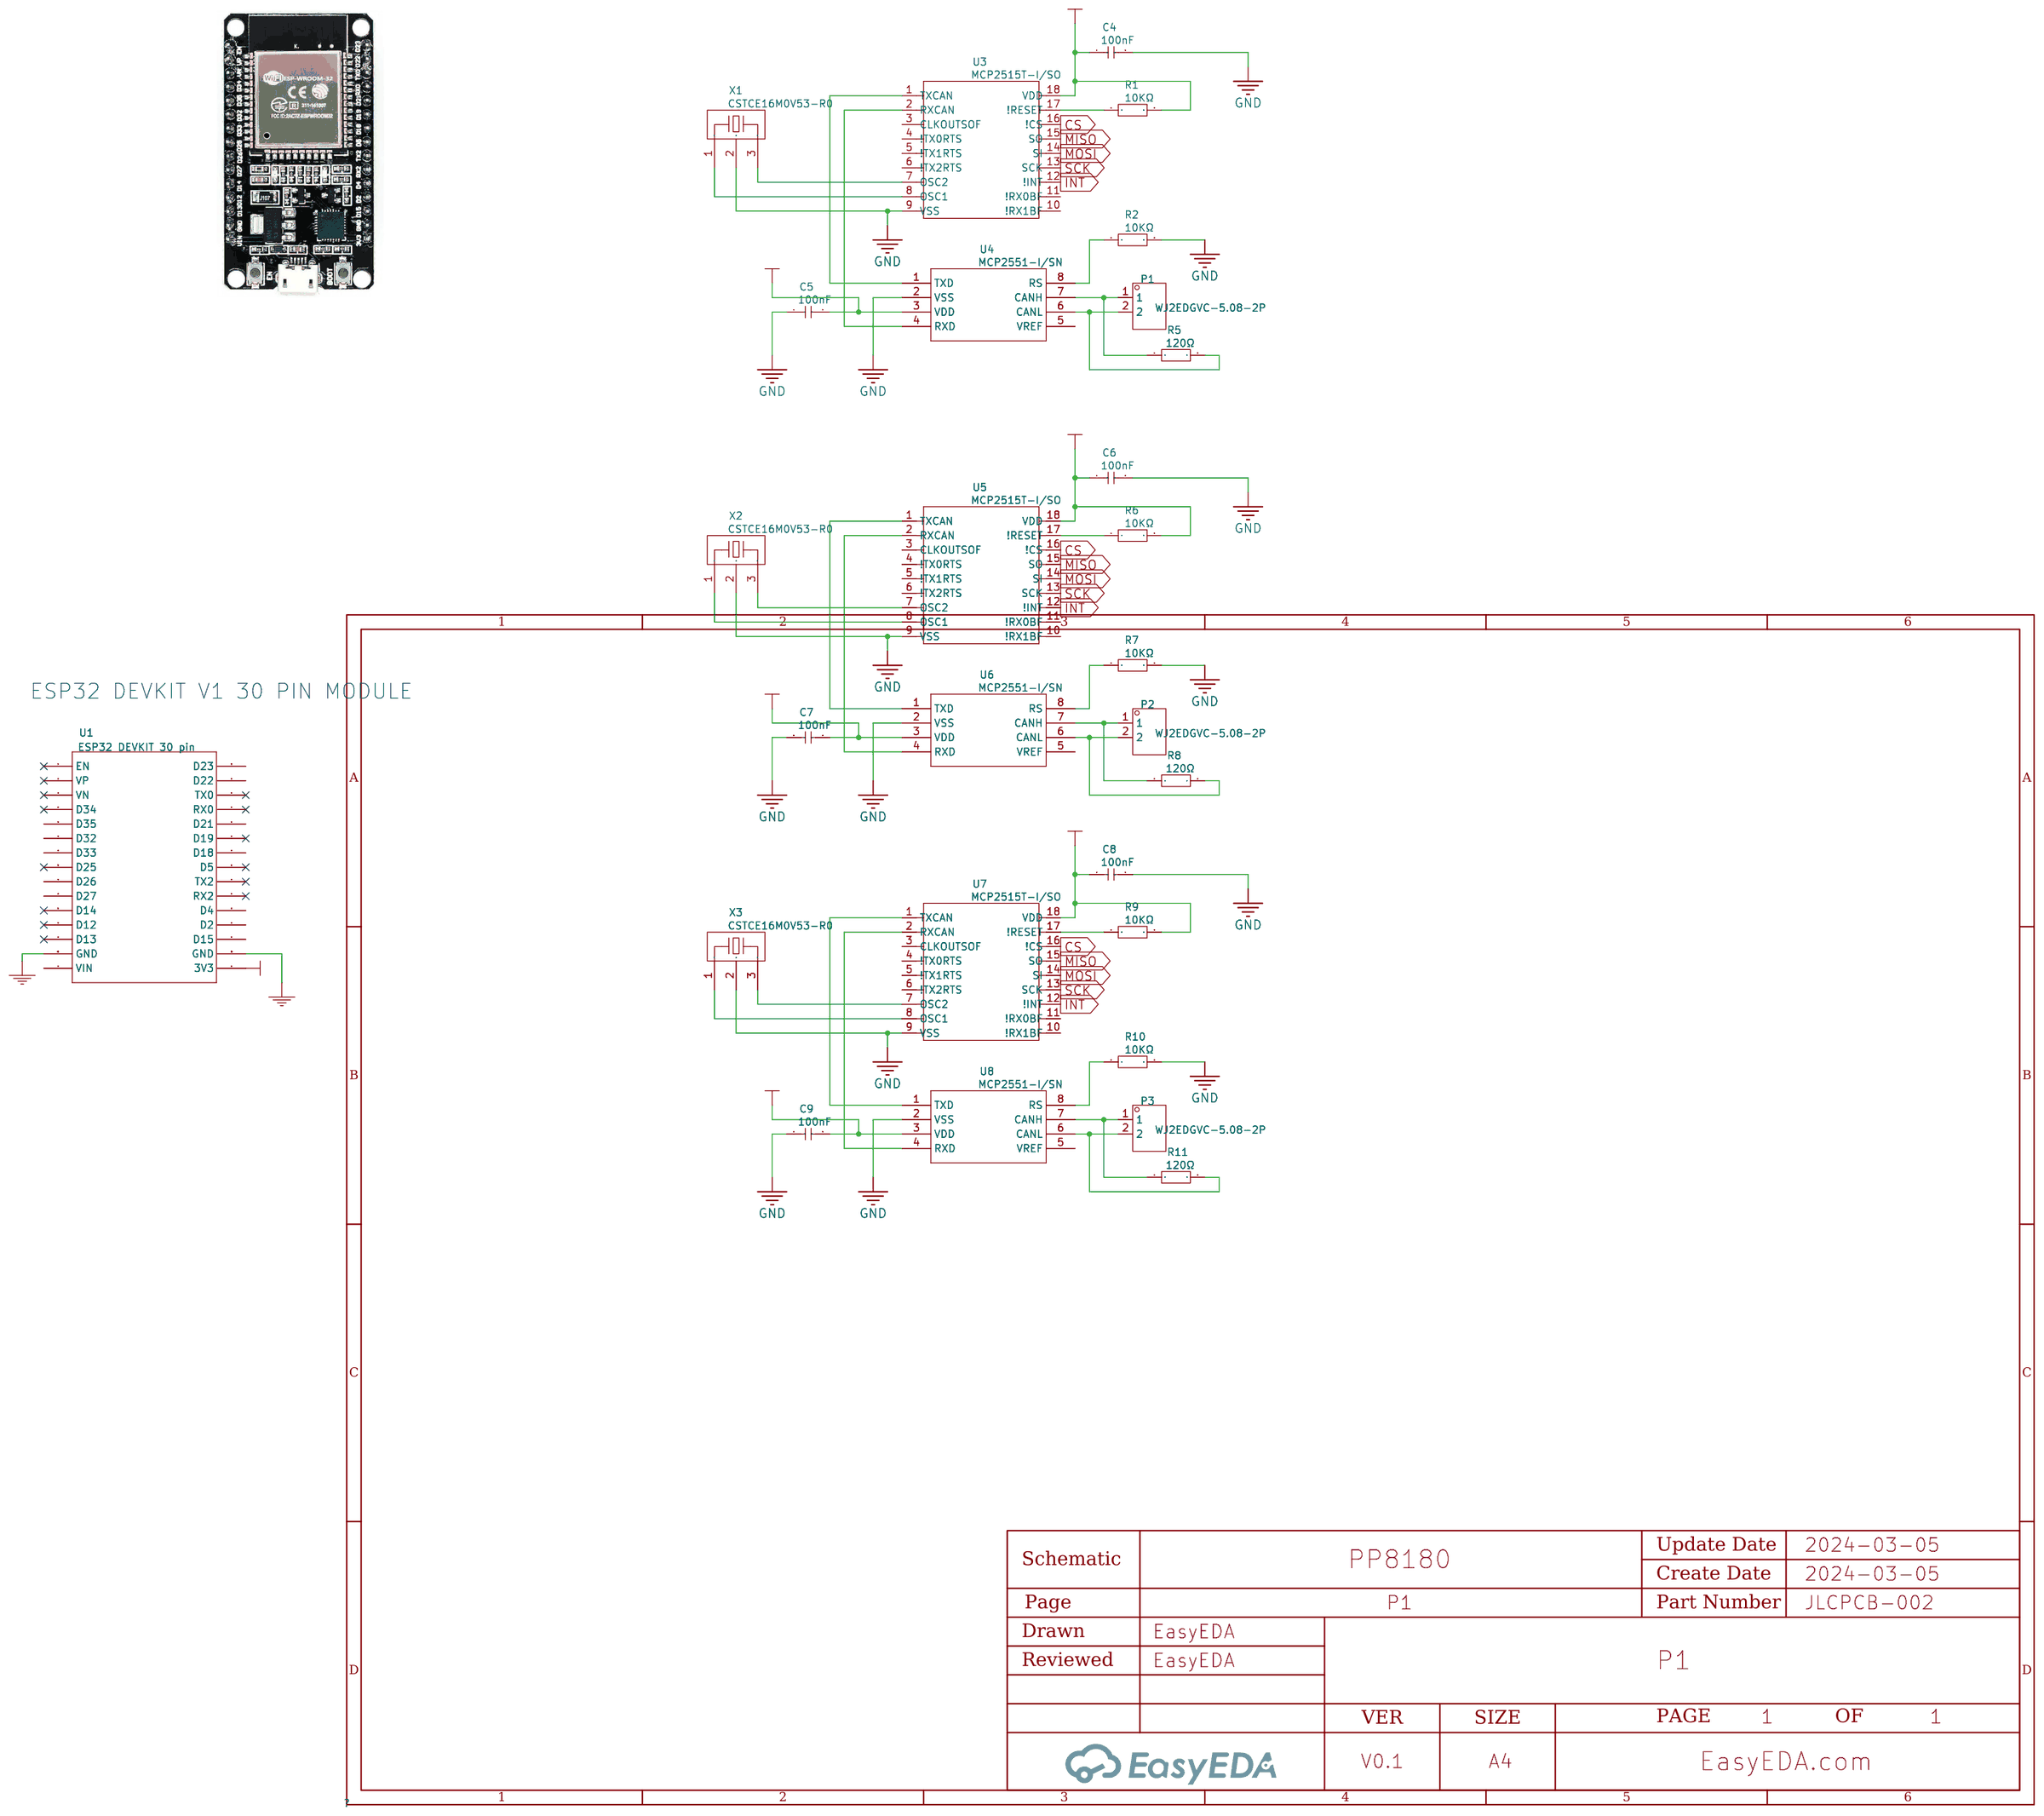
[diagram p4: schematic sheet]

## Parts
C4  100nF
C5  100nF
C6  100nF
C7  100nF
C8  100nF
C9  100nF
P1  WJ2EDGVC-5.08-2P
P2  WJ2EDGVC-5.08-2P
P3  WJ2EDGVC-5.08-2P
R1  10KΩ
R2  10KΩ
R5  120Ω
R6  10KΩ
R7  10KΩ
R8  120Ω
R9  10KΩ
R10  10KΩ
R11  120Ω
U1  ESP32 DEVKIT 30 pin
U3  MCP2515T-I/SO
U4  MCP2551-I/SN
U5  MCP2515T-I/SO
U6  MCP2551-I/SN
U7  MCP2515T-I/SO
U8  MCP2551-I/SN
X1  CSTCE16M0V53-R0
X2  CSTCE16M0V53-R0
X3  CSTCE16M0V53-R0

## Library data of the parts
C4-C9 = 100nF: SMD CAP Ceramic 100nF-50V-10%-X7R; Manufacturer Part: CC0603KRX7R9BB104
P1-P3 = WJ2EDGVC-5.08-2P: Supplier: LCSC; Manufacturer: ReliaPro; Supplier Part: C8445
R1 R2 R6 R7 R9 R10 = 10KΩ: Power: 1/10W; Tolerance: ±5%; Supplier: LCSC; Manufacturer: UniOhm; Manufacturer Part: 0603WAJ0103T5E; Supplier Part: C15401
R5 R8 R11 = 120Ω: Power: 1/10W; Tolerance: ±1%; Supplier: LCSC; Manufacturer: UniOhm; Manufacturer Part: 0603WAF1200T5E; Supplier Part: C22787
U1 = ESP32 DEVKIT 30 pin
U3 U5 U7 = MCP2515T-I/SO: SMD IC Interface;
U4 U6 U8 = MCP2551-I/SN: SMD IC Interface
X1-X3 = CSTCE16M0V53-R0: Supplier: LCSC; Manufacturer: muRata; Supplier Part: C32180

## Nets
+3V3: U1.3V3
+5V: C4.1 C5.2 C6.1 C7.2 C8.1 C9.2 R1.2 R6.2 R9.2 U3.18(VDD) U4.3(VDD) U5.18(VDD) U6.3(VDD) U7.18(VDD) U8.3(VDD)
GND: C4.2 C5.1 C6.2 C7.1 C8.2 C9.1 R2.2 R7.2 R10.2 U1.GND@1(GND) U1.GND@2(GND) U3.9(VSS) U4.2(VSS) U5.9(VSS) U6.2(VSS) U7.9(VSS) U8.2(VSS) X1.2 X2.2 X3.2
CS: U3.16(!CS) U5.16(!CS) U7.16(!CS)
INT: U3.12(!INT) U5.12(!INT) U7.12(!INT)
MISO: U3.15(SO) U5.15(SO) U7.15(SO)
MOSI: U3.14(SI) U5.14(SI) U7.14(SI)
SCK: U3.13(SCK) U5.13(SCK) U7.13(SCK)
Net-(P1-1): P1.1 R5.1 U4.7(CANH)
Net-(P1-2): P1.2 R5.2 U4.6(CANL)
Net-(P2-1): P2.1 R8.1 U6.7(CANH)
Net-(P2-2): P2.2 R8.2 U6.6(CANL)
Net-(P3-1): P3.1 R11.1 U8.7(CANH)
Net-(P3-2): P3.2 R11.2 U8.6(CANL)
Net-(R1-1): R1.1 U3.17(!RESET)
Net-(R2-1): R2.1 U4.8(RS)
Net-(R6-1): R6.1 U5.17(!RESET)
Net-(R7-1): R7.1 U6.8(RS)
Net-(R9-1): R9.1 U7.17(!RESET)
Net-(R10-1): R10.1 U8.8(RS)
Net-(U3-1): U3.1(TXCAN) U4.1(TXD)
Net-(U3-2): U3.2(RXCAN) U4.4(RXD)
Net-(U3-7): U3.7(OSC2) X1.3
Net-(U3-8): U3.8(OSC1) X1.1
Net-(U5-1): U5.1(TXCAN) U6.1(TXD)
Net-(U5-2): U5.2(RXCAN) U6.4(RXD)
Net-(U5-7): U5.7(OSC2) X2.3
Net-(U5-8): U5.8(OSC1) X2.1
Net-(U7-1): U7.1(TXCAN) U8.1(TXD)
Net-(U7-2): U7.2(RXCAN) U8.4(RXD)
Net-(U7-7): U7.7(OSC2) X3.3
Net-(U7-8): U7.8(OSC1) X3.1

Not connected (* = marked no-connect by the designer): U1 D2 D4 D5* D12* D13* D14* D15 D18 D19* D21 D22 D23 D25* D26 D27 D32 D33 D34* D35 EN* RX0* RX2* TX0* TX2* VIN VN* VP*; U3 3(CLKOUTSOF) 4(!TX0RTS) 5(!TX1RTS) 6(!TX2RTS) 10(!RX1BF) 11(!RX0BF); U4 5(VREF); U5 3(CLKOUTSOF) 4(!TX0RTS) 5(!TX1RTS) 6(!TX2RTS) 10(!RX1BF) 11(!RX0BF); U6 5(VREF); U7 3(CLKOUTSOF) 4(!TX0RTS) 5(!TX1RTS) 6(!TX2RTS) 10(!RX1BF) 11(!RX0BF); U8 5(VREF)

## Notes on the sheet
- ESP32 DEVKIT V1 30 PIN MODULE

# Schematic Schematic1

## Sheets
1 P1: Create Date: 2024-04-11; Page Name: P1; Project Name: ESP32-CAN; Schematic Name: Schematic1; Update Date: 2024-04-11; Company: EasyEDA.com; Drawn: EasyEDA; Page Size: A4; Part Number: JLCPCB-002; Reviewed: EasyEDA; Version: V0.1
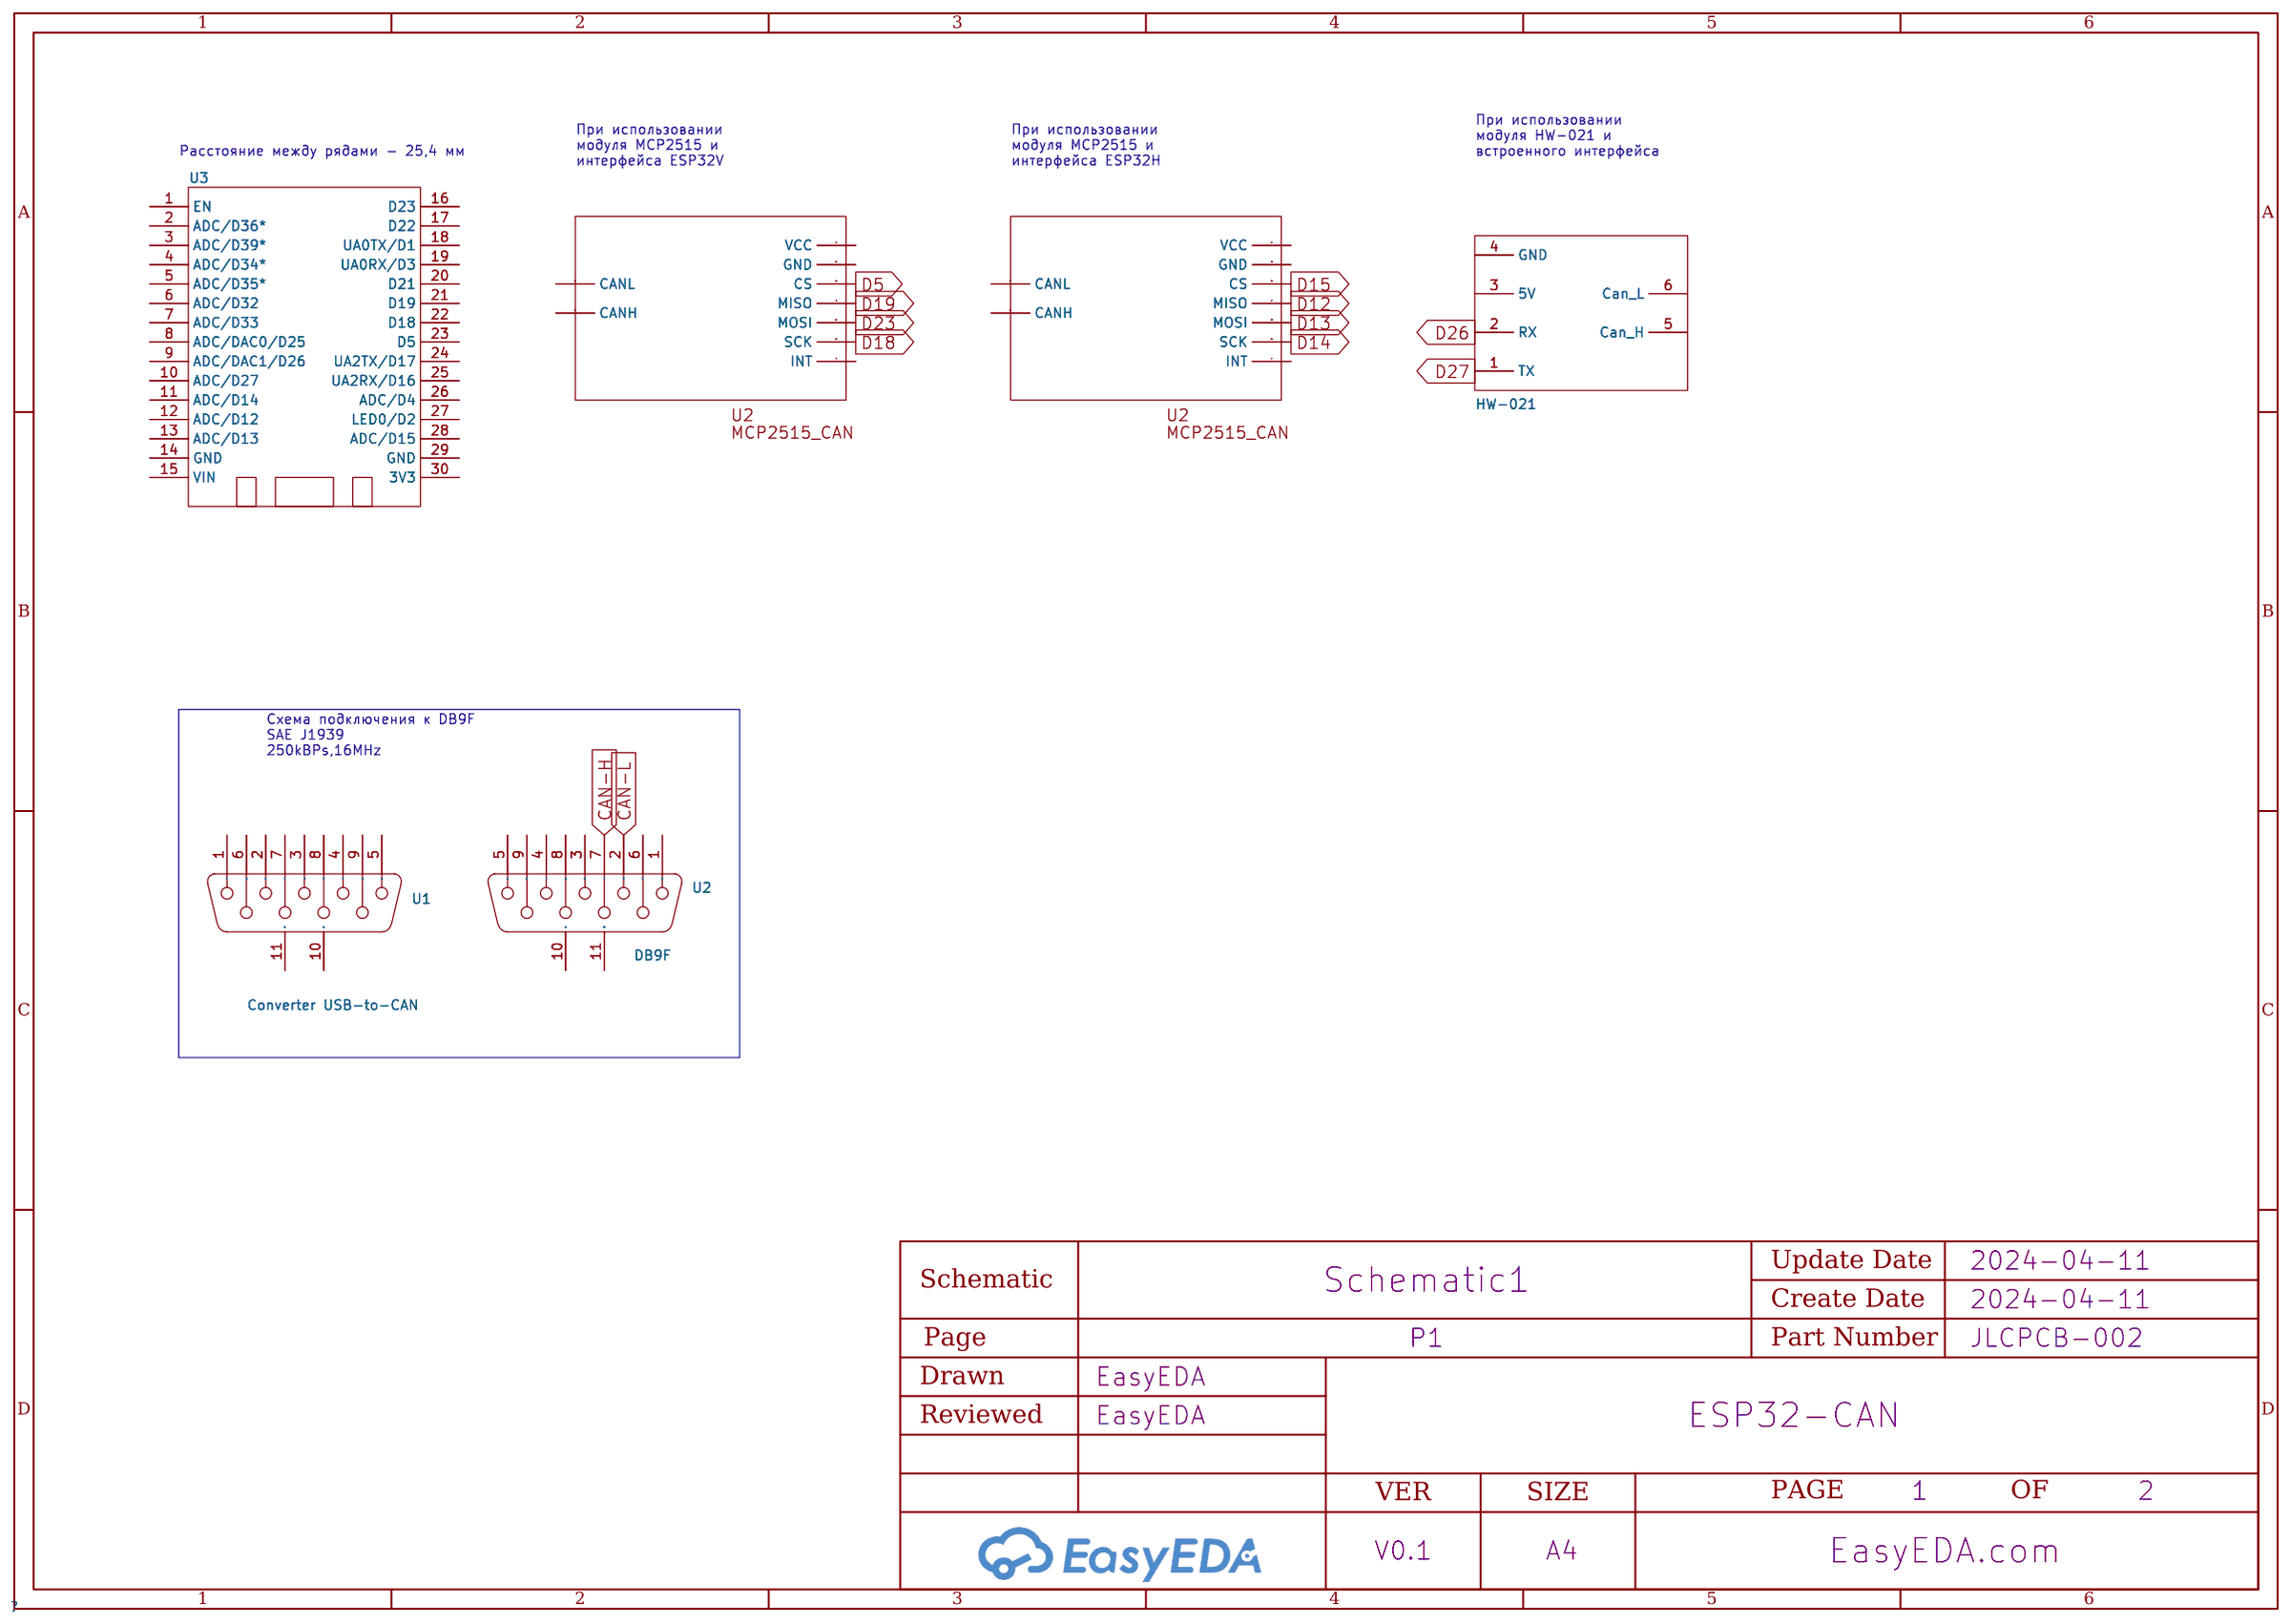
[diagram p5: P1]
2 P2: Create Date: 2024-04-18; Page Name: P2; Update Date: 2024-04-22
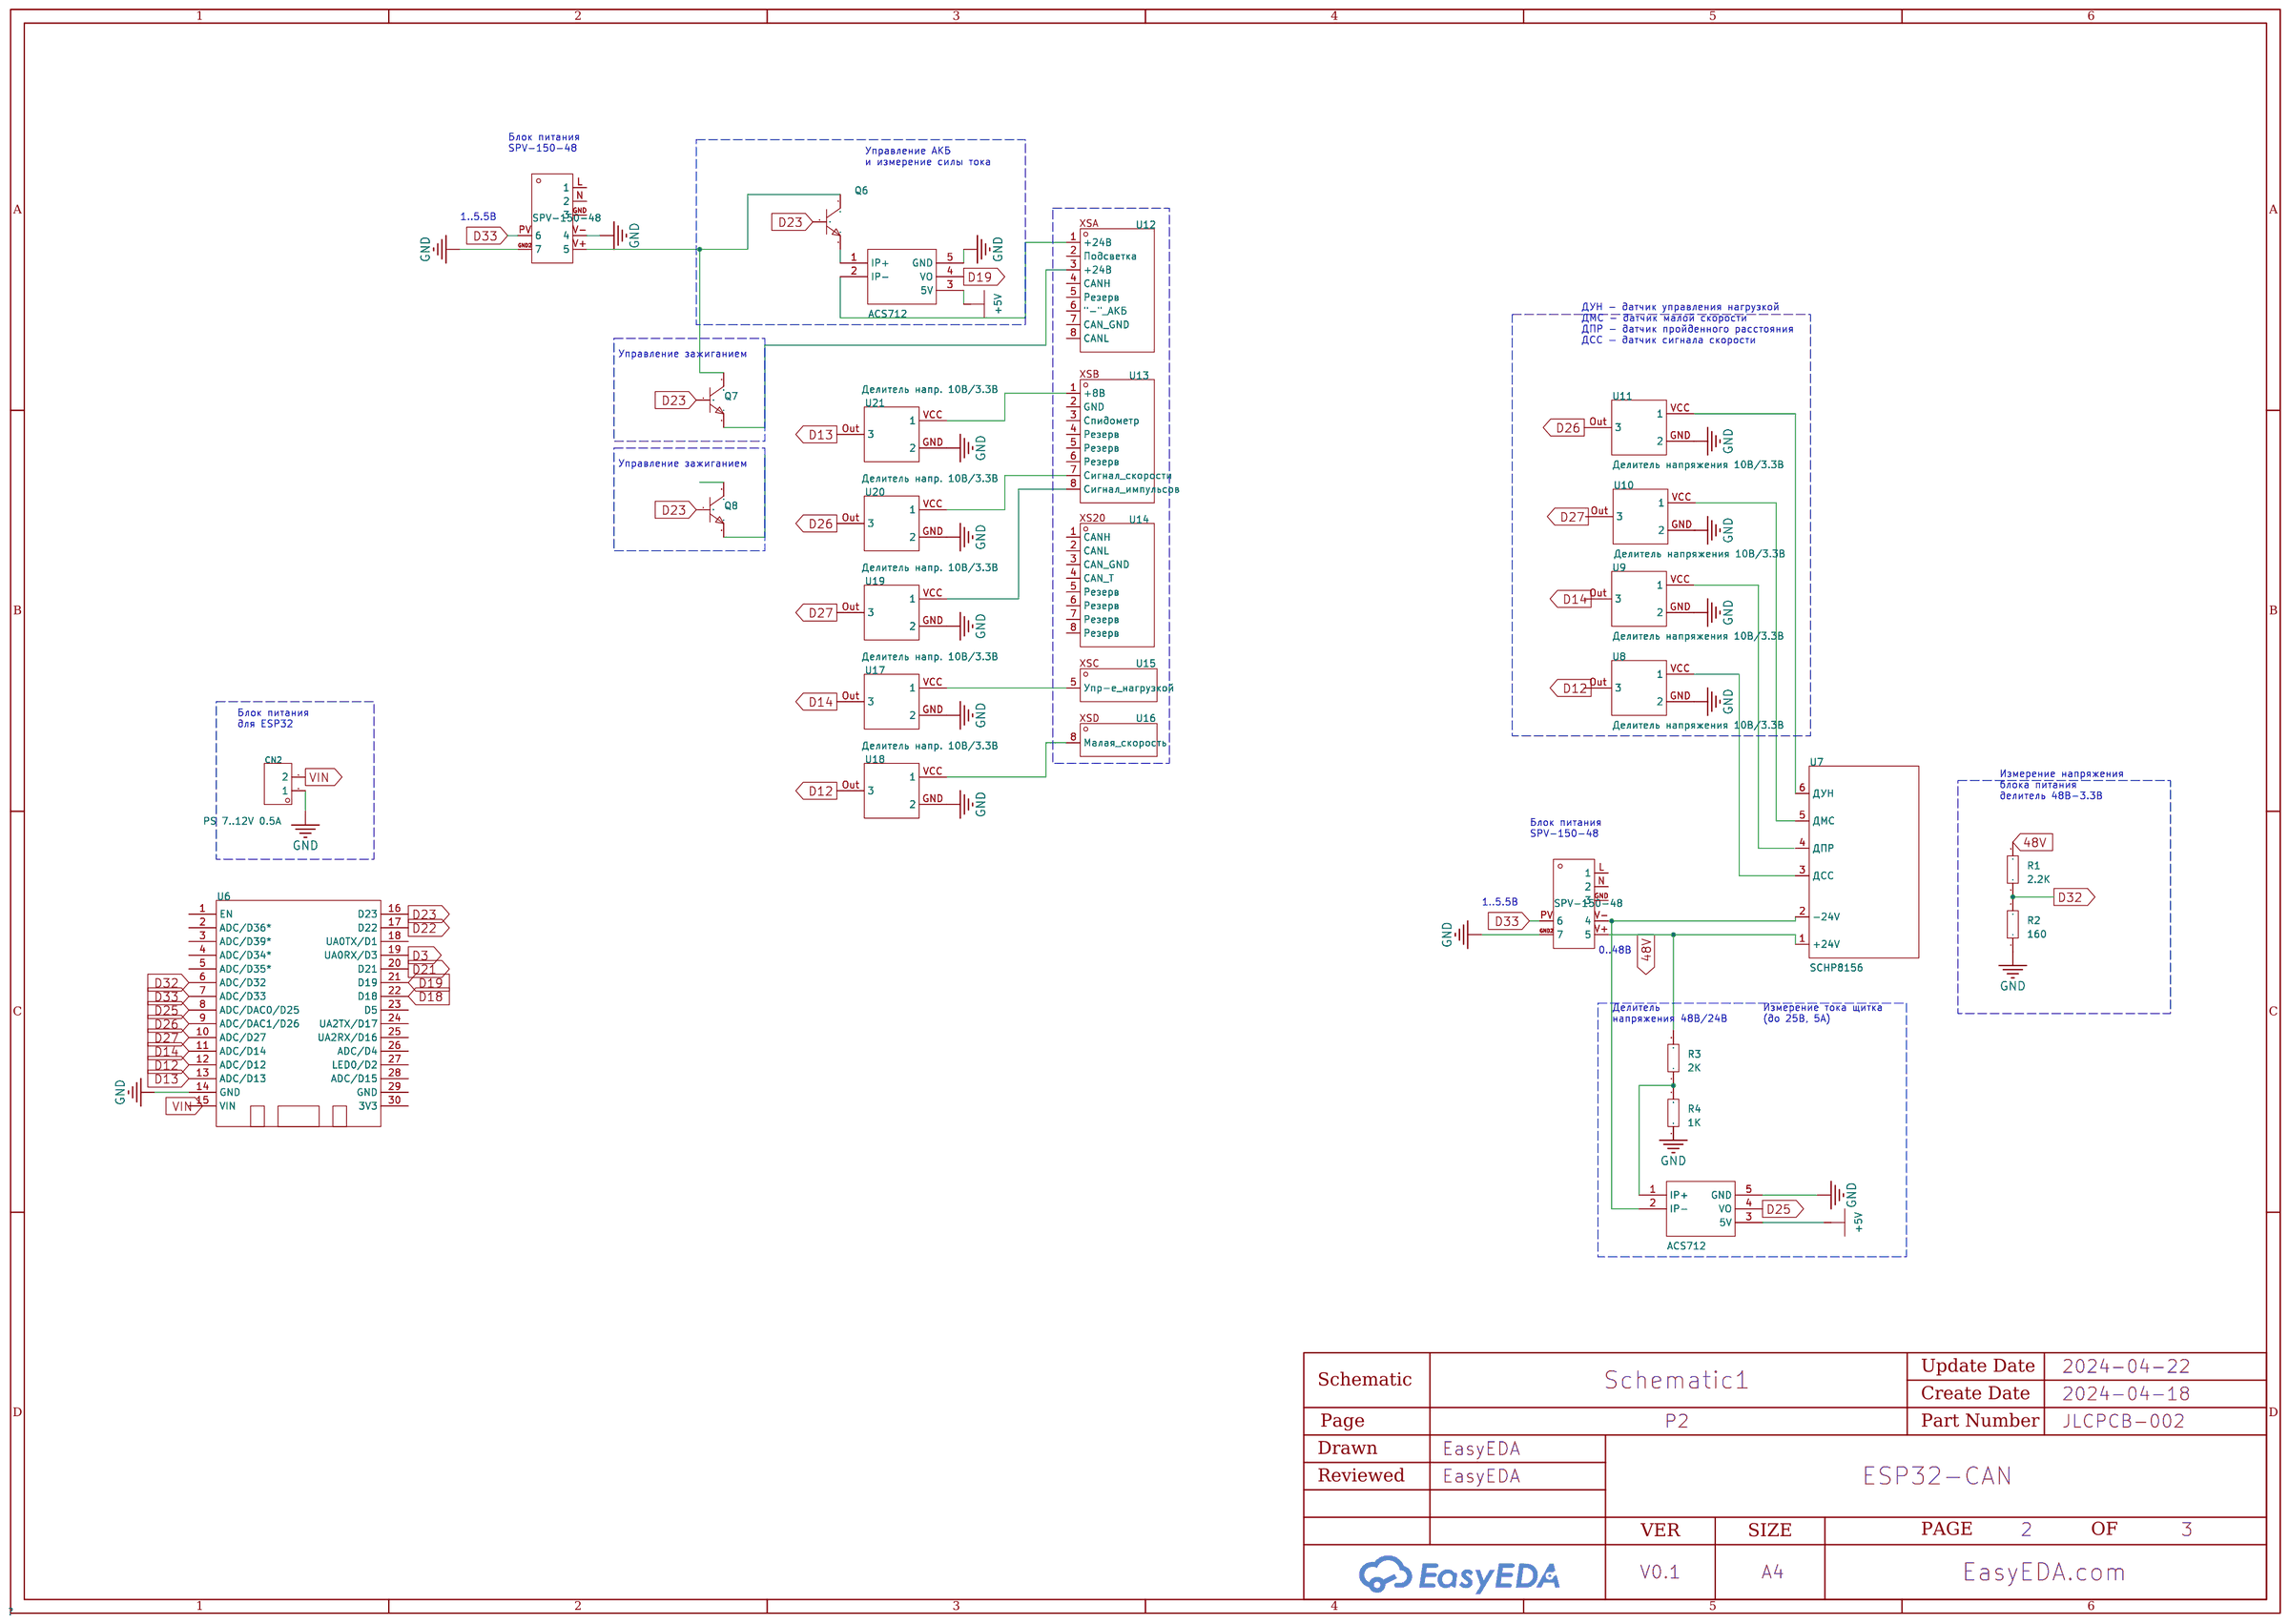
[diagram p6: P2]
3 P2a: Create Date: 2024-04-22; Page Name: P2a; Update Date: 2024-04-22; Page Size: A3; Part Number: JLCPCB-001
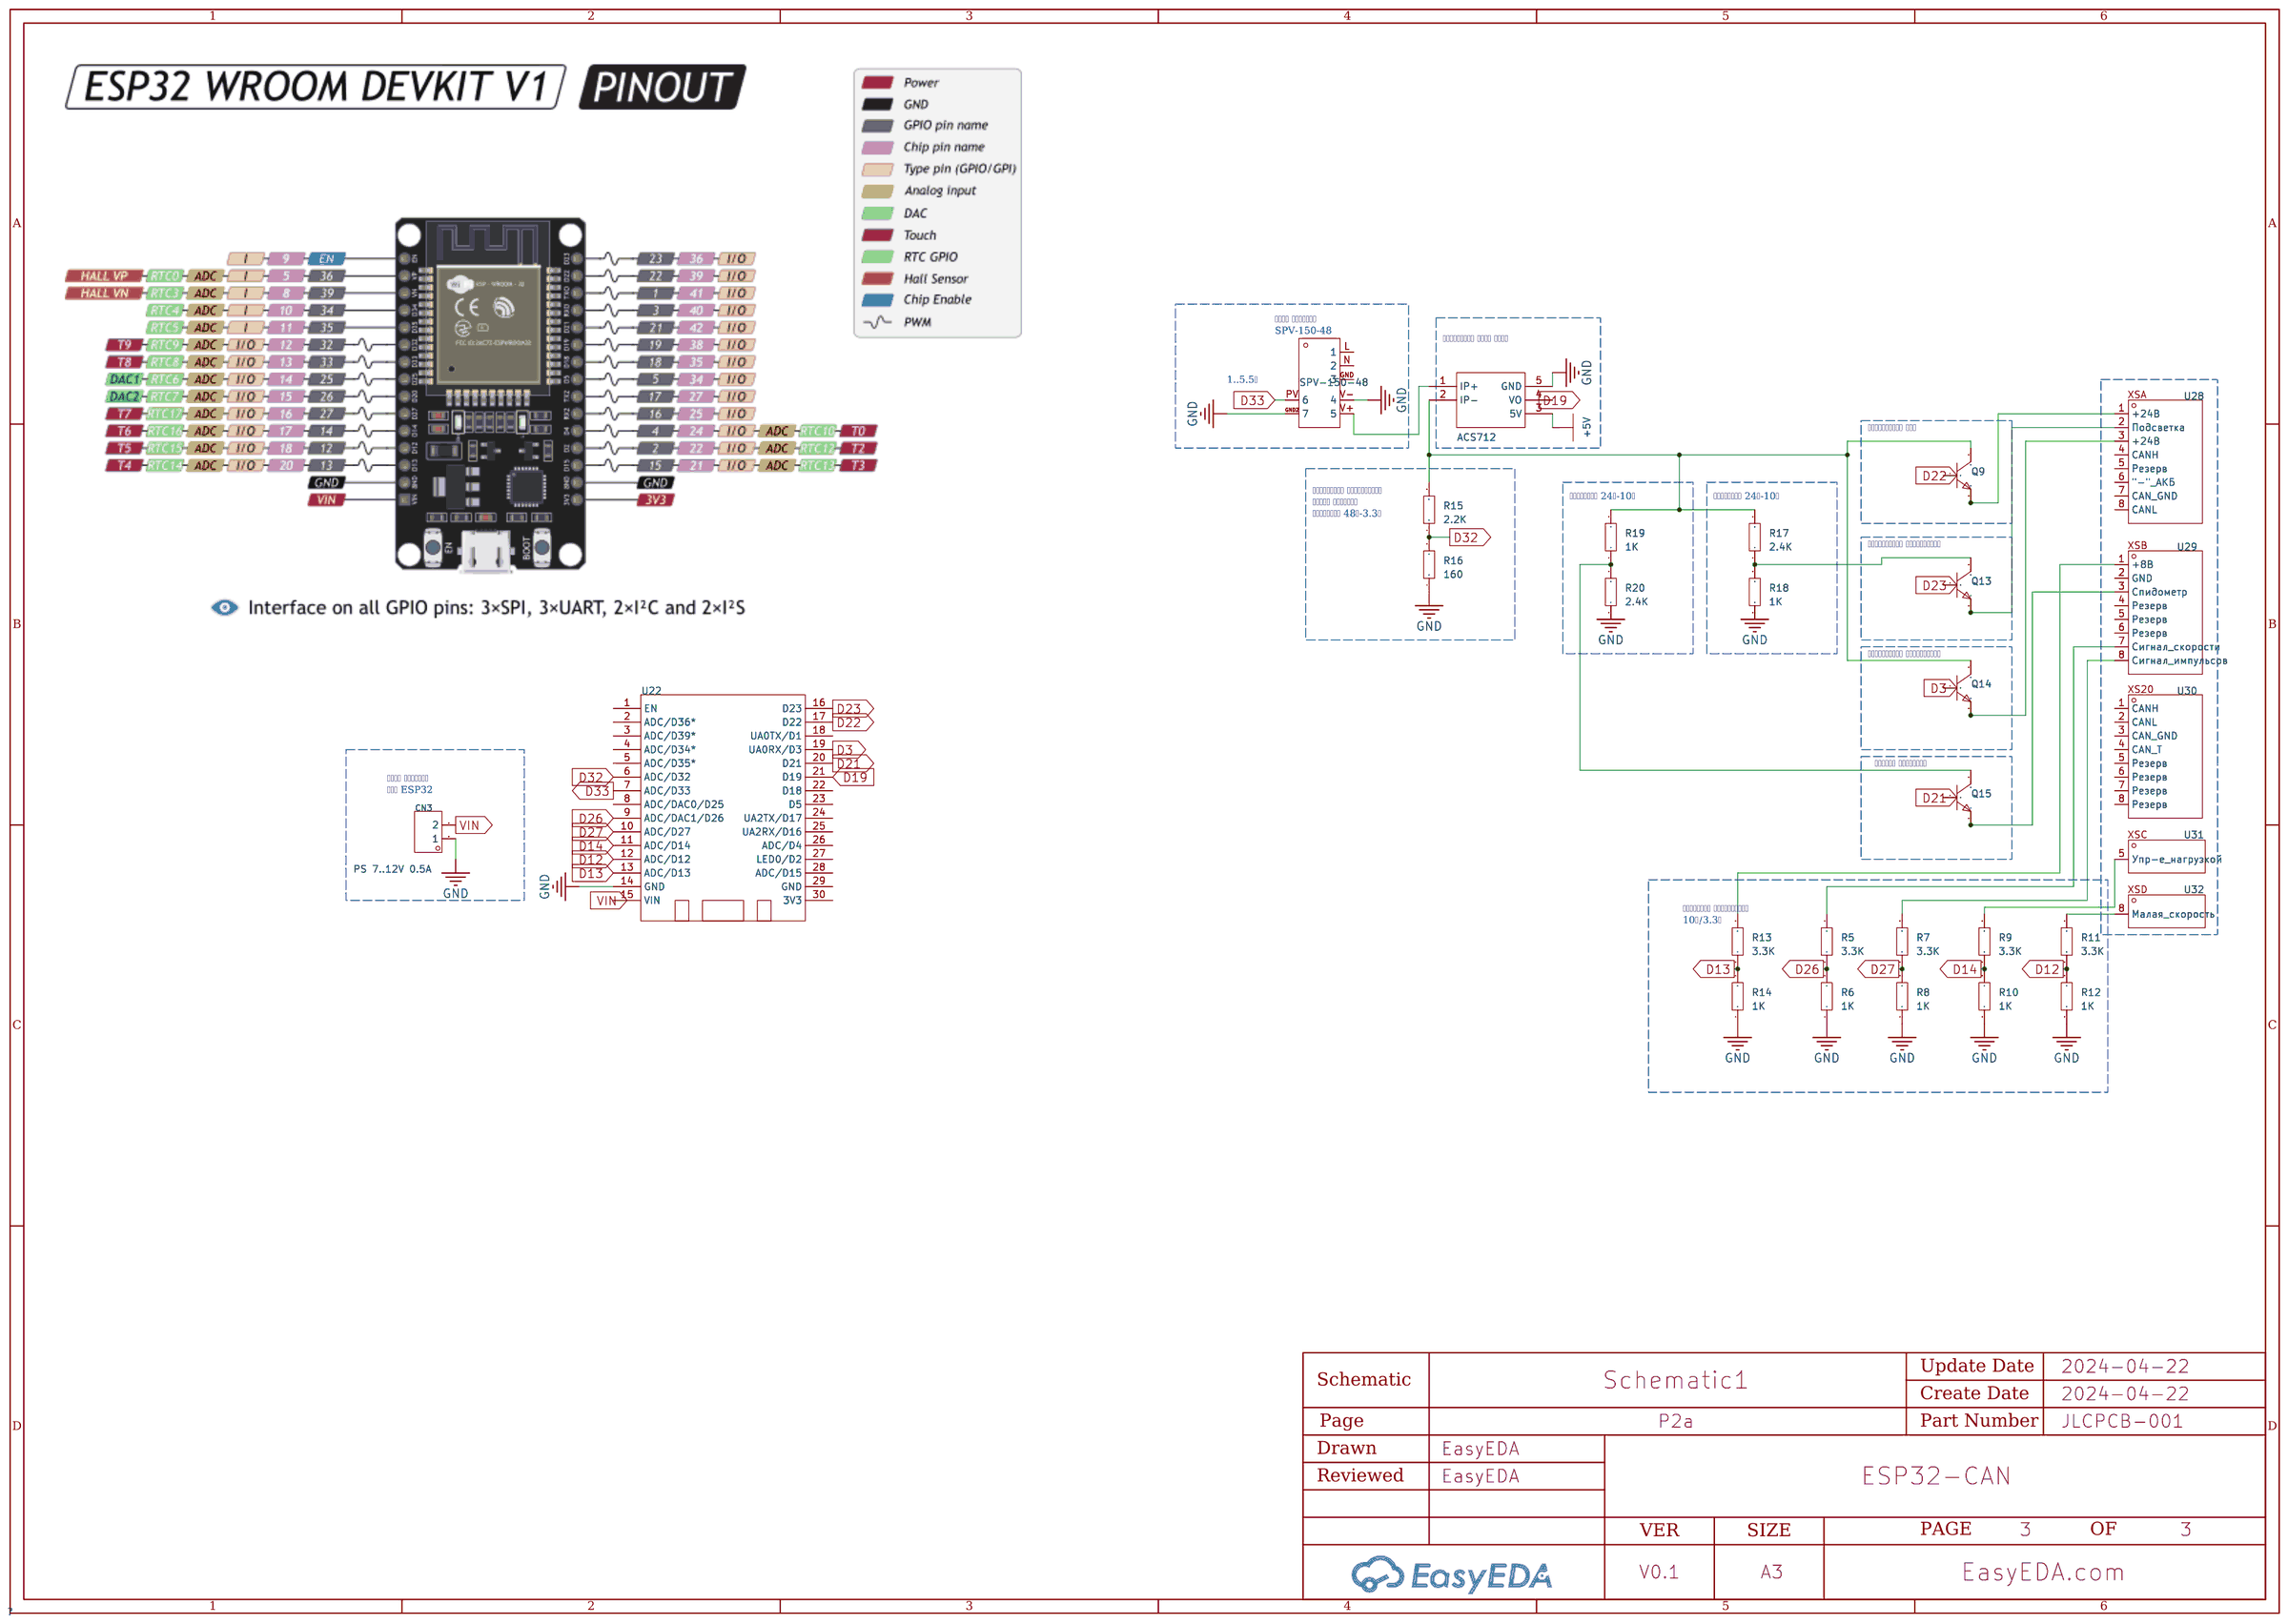
[diagram p7: P2a]
4 P3: Create Date: 2024-06-11; Page Name: P3; Project Name: ESP32-CAN (1); Update Date: 2024-07-06; Page Size: A3; Part Number: JLCPCB-001
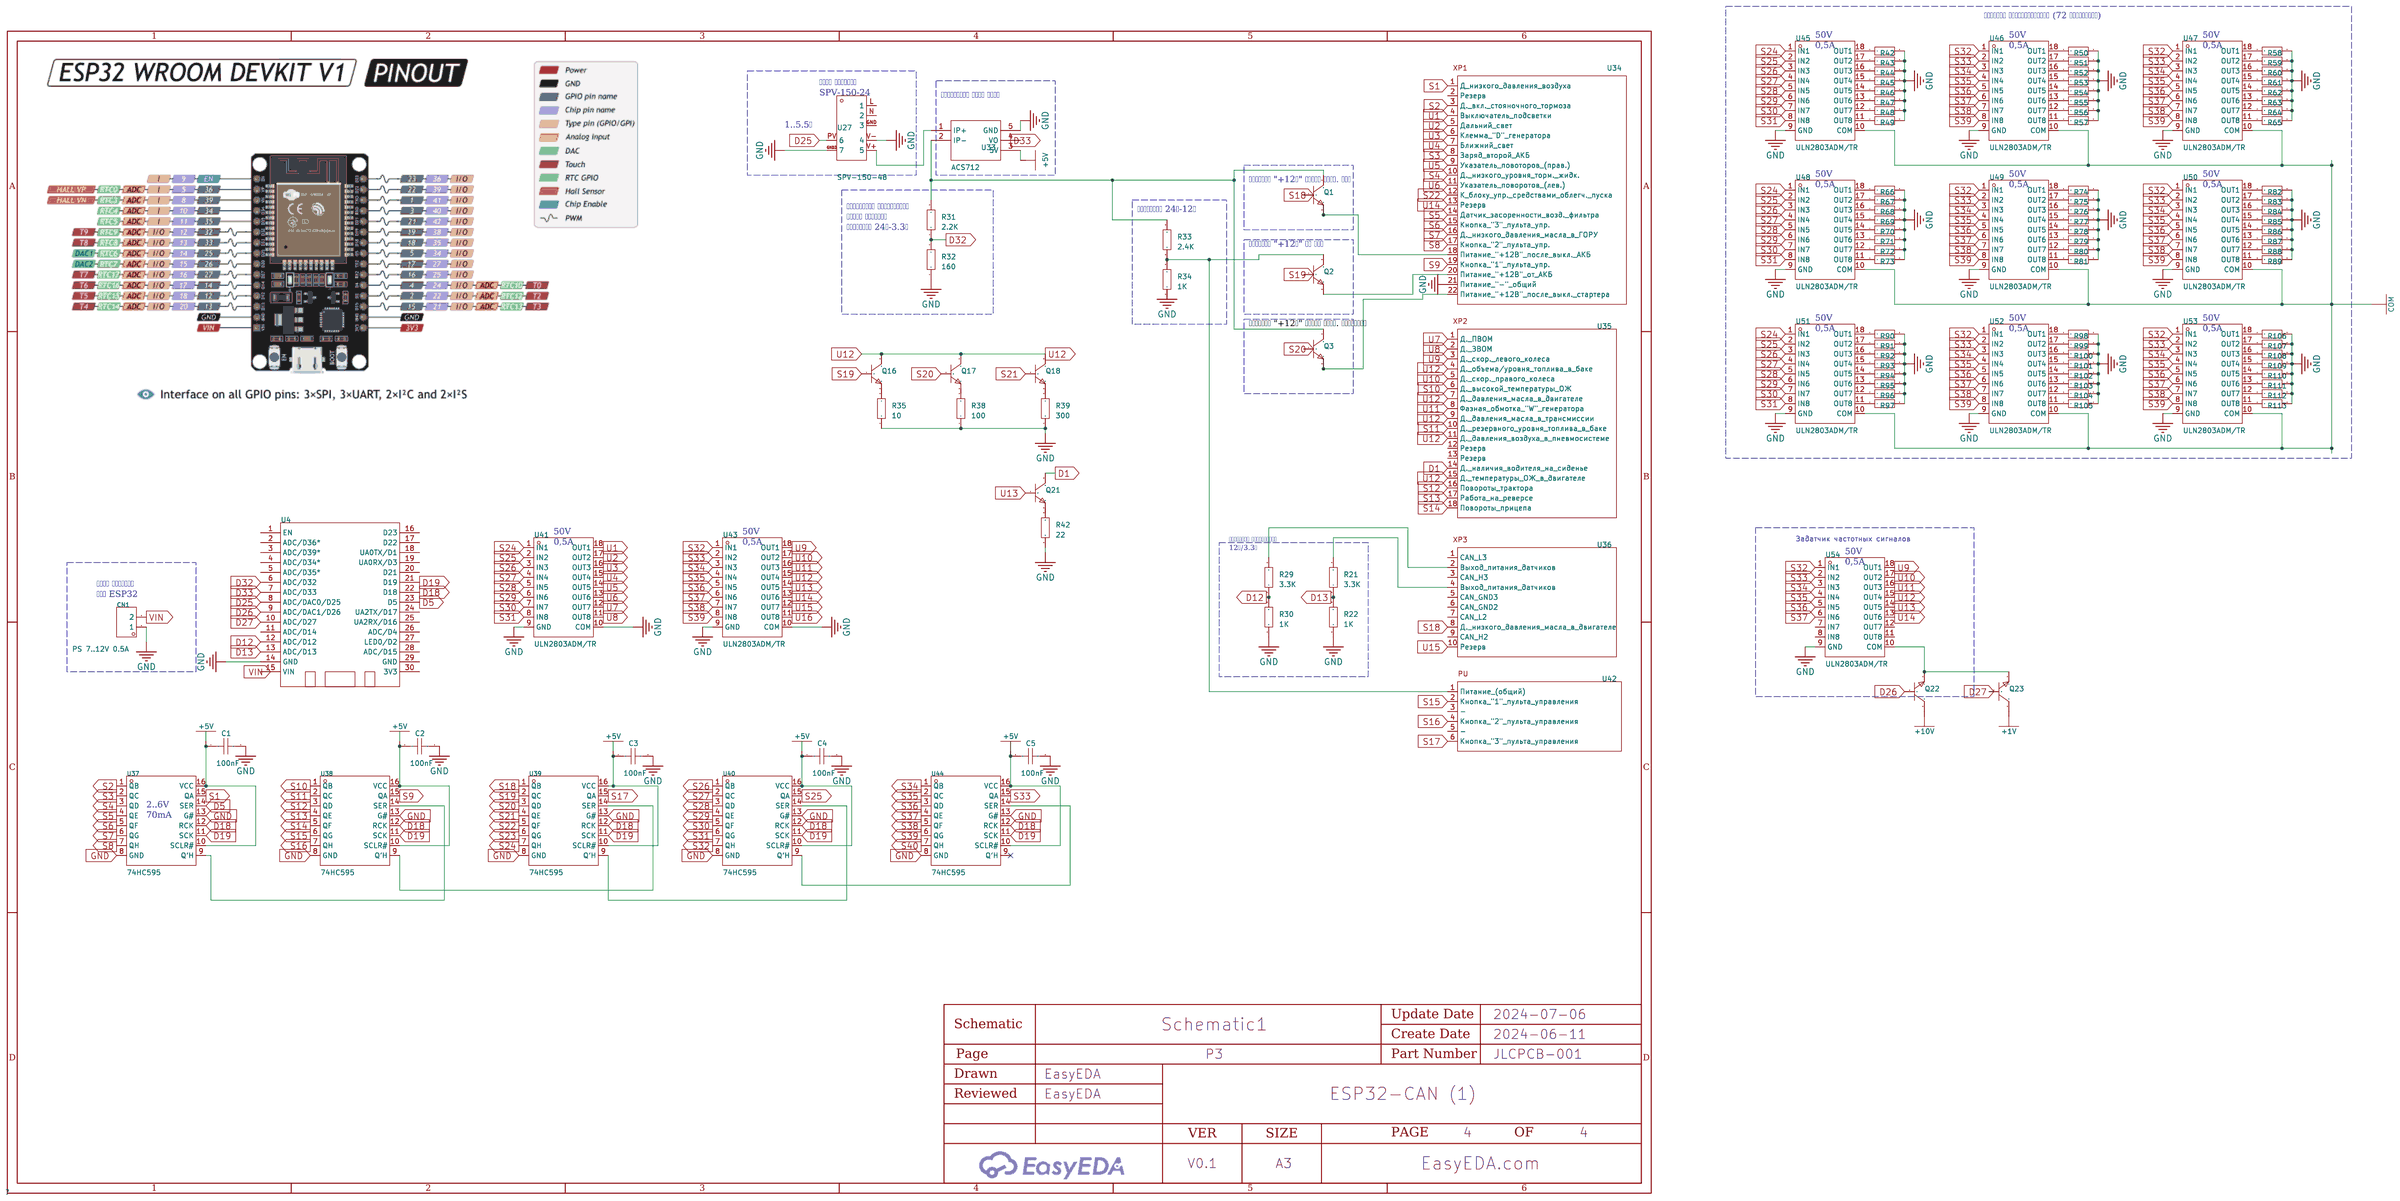
[diagram p8: P3]

## Parts
sheet P1
?#1  -
?#2  -
?#3  HW-021
U1  Converter USB-to-CAN  [DB9-TH_DB9F_C9900018961]
U2  DB9F  [DB9-TH_DB9F_C9900018961]
U3  -
sheet P2
?#4  SPV-150-48
?#5  ACS712
?#6  ACS712
?#7  SPV-150-48
CN2  PS 7..12V 0.5A  [CONN-TH_WJ2EDGVC-5.08-2P]
Q6  АКБ  [SOT-89-3_L4.5-W2.5-P1.50-LS4.2-BR]
Q7  АКБ  [SOT-89-3_L4.5-W2.5-P1.50-LS4.2-BR]
Q8  АКБ  [SOT-89-3_L4.5-W2.5-P1.50-LS4.2-BR]
R1  2.2K  [R0603]
R2  160  [R0603]
R3  2K  [R0603]
R4  1К  [R0603]
U6  -
U7  SCHP8156
U8  Делитель напряжения 10В/3.3В
U9  Делитель напряжения 10В/3.3В
U10  Делитель напряжения 10В/3.3В
U11  Делитель напряжения 10В/3.3В
U12  -
U13  -
U14  -
U15  -
U16  -
U17  Делитель напр. 10В/3.3В
U18  Делитель напр. 10В/3.3В
U19  Делитель напр. 10В/3.3В
U20  Делитель напр. 10В/3.3В
U21  Делитель напр. 10В/3.3В
sheet P2a
?#8  SPV-150-48
?#9  ACS712
CN3  PS 7..12V 0.5A  [CONN-TH_WJ2EDGVC-5.08-2P]
Q9  АКБ  [SOT-89-3_L4.5-W2.5-P1.50-LS4.2-BR]
Q13  АКБ  [SOT-89-3_L4.5-W2.5-P1.50-LS4.2-BR]
Q14  АКБ  [SOT-89-3_L4.5-W2.5-P1.50-LS4.2-BR]
Q15  АКБ  [SOT-89-3_L4.5-W2.5-P1.50-LS4.2-BR]
R5  3.3K  [R0603]
R6  1K  [R0603]
R7  3.3K  [R0603]
R8  1K  [R0603]
R9  3.3K  [R0603]
R10  1K  [R0603]
R11  3.3K  [R0603]
R12  1K  [R0603]
R13  3.3K  [R0603]
R14  1K  [R0603]
R15  2.2K  [R0603]
R16  160  [R0603]
R17  2.4K  [R0603]
R18  1K  [R0603]
R19  1K  [R0603]
R20  2.4K  [R0603]
U22  -
U28  -
U29  -
U30  -
U31  -
U32  -
sheet P3
C1  100nF  [C0603]
C2  100nF  [C0603]
C3  100nF  [C0603]
C4  100nF  [C0603]
C5  100nF  [C0603]
CN1  PS 7..12V 0.5A  [CONN-TH_WJ2EDGVC-5.08-2P]
Q1  АКБ  [SOT-89-3_L4.5-W2.5-P1.50-LS4.2-BR]
Q2  АКБ  [SOT-89-3_L4.5-W2.5-P1.50-LS4.2-BR]
Q3  АКБ  [SOT-89-3_L4.5-W2.5-P1.50-LS4.2-BR]
Q16  АКБ  [SOT-89-3_L4.5-W2.5-P1.50-LS4.2-BR]
Q17  АКБ  [SOT-89-3_L4.5-W2.5-P1.50-LS4.2-BR]
Q18  АКБ  [SOT-89-3_L4.5-W2.5-P1.50-LS4.2-BR]
Q21  АКБ  [SOT-89-3_L4.5-W2.5-P1.50-LS4.2-BR]
Q22  АКБ  [SOT-89-3_L4.5-W2.5-P1.50-LS4.2-BR]
Q23  АКБ  [SOT-89-3_L4.5-W2.5-P1.50-LS4.2-BR]
R21  3.3K  [R0603]
R22  1K  [R0603]
R29  3.3K  [R0603]
R30  1K  [R0603]
R31  2.2K  [R0603]
R32  160  [R0603]
R33  2.4K  [R0603]
R34  1K  [R0603]
R35  10  [R0603]
R38  100  [R0603]
R39  300  [R0603]
R42  22  [R0603]
R42#2  10K  [R0603]
R43  10K  [R0603]
R44  10K  [R0603]
R45  10K  [R0603]
R46  10K  [R0603]
R47  10K  [R0603]
R48  10K  [R0603]
R49  10K  [R0603]
R50  10K  [R0603]
R51  10K  [R0603]
R52  10K  [R0603]
R53  10K  [R0603]
R54  10K  [R0603]
R55  10K  [R0603]
R56  10K  [R0603]
R57  10K  [R0603]
R58  10K  [R0603]
R59  10K  [R0603]
R60  10K  [R0603]
R61  10K  [R0603]
R62  10K  [R0603]
R63  10K  [R0603]
R64  10K  [R0603]
R65  10K  [R0603]
R66  10K  [R0603]
R67  10K  [R0603]
R68  10K  [R0603]
R69  10K  [R0603]
R70  10K  [R0603]
R71  10K  [R0603]
R72  10K  [R0603]
R73  10K  [R0603]
R74  10K  [R0603]
R75  10K  [R0603]
R76  10K  [R0603]
R77  10K  [R0603]
R78  10K  [R0603]
R79  10K  [R0603]
R80  10K  [R0603]
R81  10K  [R0603]
R82  10K  [R0603]
R83  10K  [R0603]
R84  10K  [R0603]
R85  10K  [R0603]
R86  10K  [R0603]
R87  10K  [R0603]
R88  10K  [R0603]
R89  10K  [R0603]
R90  10K  [R0603]
R91  10K  [R0603]
R92  10K  [R0603]
R93  10K  [R0603]
R94  10K  [R0603]
R95  10K  [R0603]
R96  10K  [R0603]
R97  10K  [R0603]
R98  10K  [R0603]
R99  10K  [R0603]
R100  10K  [R0603]
R101  10K  [R0603]
R102  10K  [R0603]
R103  10K  [R0603]
R104  10K  [R0603]
R105  10K  [R0603]
R106  10K  [R0603]
R107  10K  [R0603]
R108  10K  [R0603]
R109  10K  [R0603]
R110  10K  [R0603]
R111  10K  [R0603]
R112  10K  [R0603]
R113  10K  [R0603]
U4  -
U27  SPV-150-48
U33  ACS712
U34  -
U35  -
U36  -
U37  74HC595  [SOP-16_L9.9-W3.9-P1.27-LS6.0-BL]
U38  74HC595  [SOP-16_L9.9-W3.9-P1.27-LS6.0-BL]
U39  74HC595  [SOP-16_L9.9-W3.9-P1.27-LS6.0-BL]
U40  74HC595  [SOP-16_L9.9-W3.9-P1.27-LS6.0-BL]
U41  ULN2803ADM/TR  [SOP-18_L11.4-W7.6-P1.27-LS10.6-BL]
U42  -
U43  ULN2803ADM/TR  [SOP-18_L11.4-W7.6-P1.27-LS10.6-BL]
U44  74HC595  [SOP-16_L9.9-W3.9-P1.27-LS6.0-BL]
U45  ULN2803ADM/TR  [SOP-18_L11.4-W7.6-P1.27-LS10.6-BL]
U46  ULN2803ADM/TR  [SOP-18_L11.4-W7.6-P1.27-LS10.6-BL]
U47  ULN2803ADM/TR  [SOP-18_L11.4-W7.6-P1.27-LS10.6-BL]
U48  ULN2803ADM/TR  [SOP-18_L11.4-W7.6-P1.27-LS10.6-BL]
U49  ULN2803ADM/TR  [SOP-18_L11.4-W7.6-P1.27-LS10.6-BL]
U50  ULN2803ADM/TR  [SOP-18_L11.4-W7.6-P1.27-LS10.6-BL]
U51  ULN2803ADM/TR  [SOP-18_L11.4-W7.6-P1.27-LS10.6-BL]
U52  ULN2803ADM/TR  [SOP-18_L11.4-W7.6-P1.27-LS10.6-BL]
U53  ULN2803ADM/TR  [SOP-18_L11.4-W7.6-P1.27-LS10.6-BL]
U54  ULN2803ADM/TR  [SOP-18_L11.4-W7.6-P1.27-LS10.6-BL]

## Library data of the parts
?#1 ?#2 = MODULE MCP2515 CANBUS
?#3 = Can_Uart 5v
U1 U2 = DB9F: Supplier Part: C9900018961; Supplier Footprint: DB9; Supplier: LCSC
U3 U4 U6 U22 = ESP32 devkit v1
?#4 ?#7 ?#8 U27 = SPV-300-48
?#5 ?#6 ?#9 U33 = Low Current Sensor - ACS712
CN1-CN3 = WJ2EDGVC-5.08-2P: Connector Type:板端/Receptacle-Close Structure:1x2P Pitch:5.08mm Color:Green Mounting Style:直针 Number of Pins:2P Number of Rows:1 Number of PINs Per Row:2; LCSC Part Name: 5.08mm 1x2P 排数:1 每排P数:2; Supplier Part: C8445; Manufacturer: KANGNEX(康奈克斯电气); Supplier Footprint: 插件,P=5.08mm; JLCPCB Part Class: Extended Part; Datasheet: https://atta.szlcsc.com/upload/public/pdf/source/20191225/C8445_EB1D2D396D429FBA4C627FE17CC77AF0.pdf; Supplier: LCSC; Connector Type: 板端/Receptacle-Close; Structure: 1x2P; Pitch: 5.08mm; Color: Green; Mounting Style: 直针; Number of Pins: 2P; Number of Rows: 1; Number of PINs Per Row: 2
Q1-Q3 Q6-Q9 Q13-Q18 Q21-Q23 = D882 Y档160~320: Transistor Type: Collector Current (Ic): Collector-Emitter Breakdown Voltage (Vceo): Power Dissipation (Pd):; LCSC Part Name: D882 Y档160~320(RANGE:160-320) Y档 160~320; Supplier Part: C9634; Manufacturer: CJ(江苏长电/长晶); Supplier Footprint: SOT-89-3; JLCPCB Part Class: Basic Part; Datasheet: https://atta.szlcsc.com/upload/public/pdf/source/20121027/1457706543612.pdf; Supplier: LCSC
R1-R22 R29-R35 R38 R39 R42 R42#2 R43-R113 = Res_0603: Supplier Footprint: 0603
U7 = SHP8156
U8-U11 U17-U21 = Voltage divider
U12 U28 = Connector XSA
U13 U29 = Connector XSB
U14 U30 = Connector XS20
U15 U31 = Connector XSС
U16 U32 = Connector XSD
C1-C5 = CAP_0603: Supplier Footprint: 0603
U34 = Connector XP1
U35 = Connector XP2
U36 = Connector XP3
U37-U40 U44 = 74HC595: Function:串行至串行或并行 Supply Voltage:2V~6V Supply Voltage:2V~6V Number of Elements:1 Number of Bits per Element:8 Output Type:Tri-State Series: Operating Temperature:-40℃~+85℃ Operating Temperature:-40℃~+85℃; Supplier Part: C18164493; Manufacturer: GR(国睿); Supplier Footprint: SOP-16; Datasheet: https://atta.szlcsc.com/upload/public/pdf/source/20230915/F264A7C02E418D1689E15579DAA93EB8.pdf; Supplier: LCSC; Function: 串行至串行或并行; Supply Voltage: 2V~6V; Number of Elements: 1; Number of Bits per Element: 8; Output Type: Tri-State; Operating Temperature: -40℃~+85℃
U41 U43 U45-U54 = ULN2803ADM/TR: number of channels:八路; Supplier Part: C2683131; Manufacturer: HGSEMI(华冠); Supplier Footprint: SOP-18-300mil; JLCPCB Part Class: Extended Part; Datasheet: https://atta.szlcsc.com/upload/public/pdf/source/20231009/94AF2541D05EF3AF782C5D5776E3D68F.pdf; Supplier: LCSC; number of channels: 八路
U42 = PU

## Nets
48V: ?#4.V+(5) R1.2 R3.2 U7.1(+24V)
+1V: Q23.2(C)
+5V: ?#5.3(5V) ?#6.3(5V) ?#9.3(5V) C1.1 C2.1 C3.1 C4.1 C5.1 U33.3(5V) U37.10(SCLR#) U37.16(VCC) U38.10(SCLR#) U38.16(VCC) U39.10(SCLR#) U39.16(VCC) U40.10(SCLR#) U40.16(VCC) U44.10(SCLR#) U44.16(VCC)
+10V: Q22.2(C)
GND: ?#4.GND2(7) ?#5.5(GND) ?#6.5(GND) ?#7.GND2(7) ?#7.V-(4) ?#8.GND2(7) ?#8.V-(4) ?#9.5(GND) C1.2 C2.2 C3.2 C4.2 C5.2 CN1.1 CN2.1 CN3.1 R2.1 R4.1 R6.1 R8.1 R10.1 R12.1 R14.1 R16.1 R18.1 R20.1 R22.1 R30.1 R32.1 R34.1 R35.1 R38.1 R39.1 R42.1 R42#2.2 R43.2 R44.2 R45.2 R46.2 R47.2 R48.2 R49.2 R50.2 R51.2 R52.2 R53.2 R54.2 R55.2 R56.2 R57.2 R58.2 R59.2 R60.2 R61.2 R62.2 R63.2 R64.2 R65.2 R66.2 R67.2 R68.2 R69.2 R70.2 R71.2 R72.2 R73.2 R74.2 R75.2 R76.2 R77.2 R78.2 R79.2 R80.2 R81.2 R82.2 R83.2 R84.2 R85.2 R86.2 R87.2 R88.2 R89.2 R90.2 R91.2 R92.2 R93.2 R94.2 R95.2 R96.2 R97.2 R98.2 R99.2 R100.2 R101.2 R102.2 R103.2 R104.2 R105.2 R106.2 R107.2 R108.2 R109.2 R110.2 R111.2 R112.2 R113.2 U4.14(GND) U6.14(GND) U8.GND(2) U9.GND(2) U10.GND(2) U11.GND(2) U17.GND(2) U18.GND(2) U19.GND(2) U20.GND(2) U21.GND(2) U22.14(GND) U27.GND2(7) U27.V-(4) U33.5(GND) U34.21(Питание "-" общий) U37.8(GND) U37.13(G#) U38.8(GND) U38.13(G#) U39.8(GND) U39.13(G#) U40.8(GND) U40.13(G#) U41.9(GND) U41.10(COM) U43.9(GND) U43.10(COM) U44.8(GND) U44.13(G#) U45.9(GND) U46.9(GND) U47.9(GND) U48.9(GND) U49.9(GND) U50.9(GND) U51.9(GND) U52.9(GND) U53.9(GND) U54.9(GND)
VIN: CN1.2 CN2.2 CN3.2 U4.15(VIN) U6.15(VIN) U22.15(VIN)
CAN-H: U2.7
CAN-L: U2.2
COM: U45.10(COM) U46.10(COM) U47.10(COM) U48.10(COM) U49.10(COM) U50.10(COM) U51.10(COM) U52.10(COM) U53.10(COM)
D1: Q21.2(C) U35.14(Д. наличия водителя на сиденье)
D3: Q14.1(B) U6.19(UA0RX/D3) U22.19(UA0RX/D3)
D5: ?#1.3(CS) U4.23(D5) U37.14(SER)
D12: ?#2.4(MISO) R11.1 R12.2 R29.1 R30.2 U4.12(ADC/D12) U6.12(ADC/D12) U8.Out(3) U18.Out(3) U22.12(ADC/D12)
D13: ?#2.5(MOSI) R13.1 R14.2 R21.1 R22.2 U4.13(ADC/D13) U6.13(ADC/D13) U21.Out(3) U22.13(ADC/D13)
D14: ?#2.6(SCK) R9.1 R10.2 U6.11(ADC/D14) U9.Out(3) U17.Out(3) U22.11(ADC/D14)
D15: ?#2.3(CS)
D18: ?#1.6(SCK) U4.22(D18) U6.22(D18) U37.12(RCK) U38.12(RCK) U39.12(RCK) U40.12(RCK) U44.12(RCK)
D19: ?#1.4(MISO) ?#6.4(VO) ?#9.4(VO) U4.21(D19) U6.21(D19) U22.21(D19) U37.11(SCK) U38.11(SCK) U39.11(SCK) U40.11(SCK) U44.11(SCK)
D21: Q15.1(B) U6.20(D21) U22.20(D21)
D22: Q9.1(B) U6.17(D22) U22.17(D22)
D23: ?#1.5(MOSI) Q6.1(B) Q7.1(B) Q8.1(B) Q13.1(B) U6.16(D23) U22.16(D23)
D25: ?#5.4(VO) U4.8(ADC/DAC0/D25) U6.8(ADC/DAC0/D25) U27.PV(6)
D26: ?#3.2(RX) Q22.1(B) R5.1 R6.2 U4.9(ADC/DAC1/D26) U6.9(ADC/DAC1/D26) U11.Out(3) U20.Out(3) U22.9(ADC/DAC1/D26)
D27: ?#3.1(TX) Q23.1(B) R7.1 R8.2 U4.10(ADC/D27) U6.10(ADC/D27) U10.Out(3) U19.Out(3) U22.10(ADC/D27)
D32: R1.1 R2.2 R15.1 R16.2 R31.1 R32.2 U4.6(ADC/D32) U6.6(ADC/D32) U22.6(ADC/D32)
D33: ?#4.PV(6) ?#7.PV(6) ?#8.PV(6) U4.7(ADC/D33) U6.7(ADC/D33) U22.7(ADC/D33) U33.4(VO)
S1: U34.1(Д низкого давления воздуха) U37.15(QA)
S2: U34.3(Д. вкл. стояночного тормоза) U37.1(QB)
S3: U34.8(Заряд второй АКБ) U37.2(QC)
S4: U34.10(Д. низкого уровня торм. жидк.) U37.3(QD)
S5: U34.14(Датчик засоренности возд. фильтра) U37.4(QE)
S6: U34.15(Кнопка "3" пульта упр.) U37.5(QF)
S7: U34.16(Д. низкого давления масла в ГОРУ) U37.6(QG)
S8: U34.17(Кнопка "2" пульта упр.) U37.7(QH)
S9: U34.19(Кнопка "1" пульта упр.) U38.15(QA)
S10: U35.6(Д. высокой температуры ОЖ) U38.1(QB)
S11: U35.10(Д. резервного уровня топлива в баке) U38.2(QC)
S12: U35.16(Повороты трактора) U38.3(QD)
S13: U35.17(Работа на реверсе) U38.4(QE)
S14: U35.18(Повороты прицепа) U38.5(QF)
S15: U38.6(QG) U42.2(Кнопка "1" пульта управления)
S16: U38.7(QH) U42.4(Кнопка "2" пульта управления)
S17: U39.15(QA) U42.6(Кнопка "3" пульта управления)
S18: Q1.1(B) U36.8(Д. низкого давления масла в двигателе) U39.1(QB)
S19: Q2.1(B) Q16.1(B) U39.2(QC)
S20: Q3.1(B) Q17.1(B) U39.3(QD)
S21: Q18.1(B) U39.4(QE)
S22: U34.12(К блоку упр. средствами облегч. пуска) U39.5(QF)
S23: U39.6(QG)
S24: U39.7(QH) U41.1(IN1) U45.1(IN1) U48.1(IN1) U51.1(IN1)
S25: U40.15(QA) U41.2(IN2) U45.2(IN2) U48.2(IN2) U51.2(IN2)
S26: U40.1(QB) U41.3(IN3) U45.3(IN3) U48.3(IN3) U51.3(IN3)
S27: U40.2(QC) U41.4(IN4) U45.4(IN4) U48.4(IN4) U51.4(IN4)
S28: U40.3(QD) U41.5(IN5) U45.5(IN5) U48.5(IN5) U51.5(IN5)
S29: U40.4(QE) U41.6(IN6) U45.6(IN6) U48.6(IN6) U51.6(IN6)
S30: U40.5(QF) U41.7(IN7) U45.7(IN7) U48.7(IN7) U51.7(IN7)
S31: U40.6(QG) U41.8(IN8) U45.8(IN8) U48.8(IN8) U51.8(IN8)
S32: U40.7(QH) U43.1(IN1) U46.1(IN1) U47.1(IN1) U49.1(IN1) U50.1(IN1) U52.1(IN1) U53.1(IN1) U54.1(IN1)
S33: U43.2(IN2) U44.15(QA) U46.2(IN2) U47.2(IN2) U49.2(IN2) U50.2(IN2) U52.2(IN2) U53.2(IN2) U54.2(IN2)
S34: U43.3(IN3) U44.1(QB) U46.3(IN3) U47.3(IN3) U49.3(IN3) U50.3(IN3) U52.3(IN3) U53.3(IN3) U54.3(IN3)
S35: U43.4(IN4) U44.2(QC) U46.4(IN4) U47.4(IN4) U49.4(IN4) U50.4(IN4) U52.4(IN4) U53.4(IN4) U54.4(IN4)
S36: U43.5(IN5) U44.3(QD) U46.5(IN5) U47.5(IN5) U49.5(IN5) U50.5(IN5) U52.5(IN5) U53.5(IN5) U54.5(IN5)
S37: U43.6(IN6) U44.4(QE) U46.6(IN6) U47.6(IN6) U49.6(IN6) U50.6(IN6) U52.6(IN6) U53.6(IN6) U54.6(IN6)
S38: U43.7(IN7) U44.5(QF) U46.7(IN7) U47.7(IN7) U49.7(IN7) U50.7(IN7) U52.7(IN7) U53.7(IN7)
S39: U43.8(IN8) U44.6(QG) U46.8(IN8) U47.8(IN8) U49.8(IN8) U50.8(IN8) U52.8(IN8) U53.8(IN8)
S40: U44.7(QH)
U1: U34.4(Выключатель подсветки) U41.18(OUT1)
U2: U34.5(Дальний свет) U41.17(OUT2)
U3: U34.6(Клемма "D" генератора) U41.16(OUT3)
U4: U34.7(Ближний свет) U41.15(OUT4)
U5: U34.9(Указатель повоторов (прав.)) U41.14(OUT5)
U6: U34.11(Указатель поворотов (лев.)) U41.13(OUT6)
U7: U35.1(Д. ПВОМ) U41.12(OUT7)
U8: U35.2(Д. ЗВОМ) U41.11(OUT8)
U9: U35.3(Д. скор. левого колеса) U43.18(OUT1) U54.18(OUT1)
U10: U35.5(Д. скор. правого колеса) U43.17(OUT2) U54.17(OUT2)
U11: U35.8(Фазная обмотка "W" генератора) U43.16(OUT3) U54.16(OUT3)
U12: Q16.2(C) Q17.2(C) Q18.2(C) U35.4(Д. объема/уровня топлива в баке) U35.7(Д. давления масла в двигателе) U35.9(Д. давления масла в трансмиссии) U35.11(Д. давления воздуха в пневмосистеме) U35.15(Д. температуры ОЖ в двигателе) U43.15(OUT4) U54.15(OUT4)
U13: Q21.1(B) U43.14(OUT5) U54.14(OUT5)
U14: U34.13(Резерв) U43.13(OUT6) U54.13(OUT6)
U15: U36.10(Резерв) U43.12(OUT7)
U16: U43.11(OUT8)
Net-(?#4-V-): ?#4.V-(4) ?#5.2(IP-) U7.2(-24V)
Net-(?#5-1): ?#5.1(IP+) R3.1 R4.2
Net-(?#6-1): ?#6.1(IP+) Q6.3(E)
Net-(?#6-2): ?#6.2(IP-) U12.1(+24В)
Net-(?#7-V+): ?#7.V+(5) Q6.2(C) Q7.2(C)
Net-(?#8-V+): ?#8.V+(5) ?#9.1(IP+)
Net-(?#9-2): ?#9.2(IP-) Q9.2(C) Q14.2(C) R15.2 R17.2 R19.2
Net-(Q1-2): Q1.2(C) Q3.2(C) R31.2 R33.2 U33.2(IP-)
Net-(Q1-3): Q1.3(E) U34.18(Питание "+12В" после выкл. АКБ)
Net-(Q2-2): Q2.2(C) R33.1 R34.2 U42.1(Питание (общий))
Net-(Q2-3): Q2.3(E) U34.20(Питание "+12В" от АКБ)
Net-(Q3-3): Q3.3(E) U34.22(Питание "+12В" после выкл. стартера)
Net-(Q7-3): Q7.3(E) U12.3(+24В)
Net-(Q9-3): Q9.3(E) U28.1(+24В)
Net-(Q13-2): Q13.2(C) R17.1 R18.2
Net-(Q13-3): Q13.3(E) U28.2(Подсветка)
Net-(Q14-3): Q14.3(E) U28.3(+24В)
Net-(Q15-2): Q15.2(C) R19.1 R20.2
Net-(Q15-3): Q15.3(E) U29.3(Спидометр)
Net-(Q16-3): Q16.3(E) R35.2
Net-(Q17-3): Q17.3(E) R38.2
Net-(Q18-3): Q18.3(E) R39.2
Net-(Q21-3): Q21.3(E) R42.2
Net-(Q22-3): Q22.3(E) Q23.3(E) U54.10(COM)
Net-(R5-2): R5.2 U29.7(Сигнал скорости)
Net-(R7-2): R7.2 U29.8(Сигнал импульсов)
Net-(R9-2): R9.2 U31.5(Упр-е нагрузкой)
Net-(R11-2): R11.2 U32.8(Малая скорость)
Net-(R13-2): R13.2 U29.1(+8В)
Net-(R21-2): R21.2 U36.4(Выход питания датчиков)
Net-(R29-2): R29.2 U36.2(Выход питания датчиков)
Net-(R42#2-1): R42#2.1 U45.18(OUT1)
Net-(R43-1): R43.1 U45.17(OUT2)
Net-(R44-1): R44.1 U45.16(OUT3)
Net-(R45-1): R45.1 U45.15(OUT4)
Net-(R46-1): R46.1 U45.14(OUT5)
Net-(R47-1): R47.1 U45.13(OUT6)
Net-(R48-1): R48.1 U45.12(OUT7)
Net-(R49-1): R49.1 U45.11(OUT8)
Net-(R50-1): R50.1 U46.18(OUT1)
Net-(R51-1): R51.1 U46.17(OUT2)
Net-(R52-1): R52.1 U46.16(OUT3)
Net-(R53-1): R53.1 U46.15(OUT4)
Net-(R54-1): R54.1 U46.14(OUT5)
Net-(R55-1): R55.1 U46.13(OUT6)
Net-(R56-1): R56.1 U46.12(OUT7)
Net-(R57-1): R57.1 U46.11(OUT8)
Net-(R58-1): R58.1 U47.18(OUT1)
Net-(R59-1): R59.1 U47.17(OUT2)
Net-(R60-1): R60.1 U47.16(OUT3)
Net-(R61-1): R61.1 U47.15(OUT4)
Net-(R62-1): R62.1 U47.14(OUT5)
Net-(R63-1): R63.1 U47.13(OUT6)
Net-(R64-1): R64.1 U47.12(OUT7)
Net-(R65-1): R65.1 U47.11(OUT8)
Net-(R66-1): R66.1 U48.18(OUT1)
Net-(R67-1): R67.1 U48.17(OUT2)
Net-(R68-1): R68.1 U48.16(OUT3)
Net-(R69-1): R69.1 U48.15(OUT4)
Net-(R70-1): R70.1 U48.14(OUT5)
Net-(R71-1): R71.1 U48.13(OUT6)
Net-(R72-1): R72.1 U48.12(OUT7)
Net-(R73-1): R73.1 U48.11(OUT8)
Net-(R74-1): R74.1 U49.18(OUT1)
Net-(R75-1): R75.1 U49.17(OUT2)
Net-(R76-1): R76.1 U49.16(OUT3)
Net-(R77-1): R77.1 U49.15(OUT4)
Net-(R78-1): R78.1 U49.14(OUT5)
Net-(R79-1): R79.1 U49.13(OUT6)
Net-(R80-1): R80.1 U49.12(OUT7)
Net-(R81-1): R81.1 U49.11(OUT8)
Net-(R82-1): R82.1 U50.18(OUT1)
Net-(R83-1): R83.1 U50.17(OUT2)
Net-(R84-1): R84.1 U50.16(OUT3)
Net-(R85-1): R85.1 U50.15(OUT4)
Net-(R86-1): R86.1 U50.14(OUT5)
Net-(R87-1): R87.1 U50.13(OUT6)
Net-(R88-1): R88.1 U50.12(OUT7)
Net-(R89-1): R89.1 U50.11(OUT8)
Net-(R90-1): R90.1 U51.18(OUT1)
Net-(R91-1): R91.1 U51.17(OUT2)
Net-(R92-1): R92.1 U51.16(OUT3)
Net-(R93-1): R93.1 U51.15(OUT4)
Net-(R94-1): R94.1 U51.14(OUT5)
Net-(R95-1): R95.1 U51.13(OUT6)
Net-(R96-1): R96.1 U51.12(OUT7)
Net-(R97-1): R97.1 U51.11(OUT8)
Net-(R98-1): R98.1 U52.18(OUT1)
Net-(R99-1): R99.1 U52.17(OUT2)
Net-(R100-1): R100.1 U52.16(OUT3)
Net-(R101-1): R101.1 U52.15(OUT4)
Net-(R102-1): R102.1 U52.14(OUT5)
Net-(R103-1): R103.1 U52.13(OUT6)
Net-(R104-1): R104.1 U52.12(OUT7)
Net-(R105-1): R105.1 U52.11(OUT8)
Net-(R106-1): R106.1 U53.18(OUT1)
Net-(R107-1): R107.1 U53.17(OUT2)
Net-(R108-1): R108.1 U53.16(OUT3)
Net-(R109-1): R109.1 U53.15(OUT4)
Net-(R110-1): R110.1 U53.14(OUT5)
Net-(R111-1): R111.1 U53.13(OUT6)
Net-(R112-1): R112.1 U53.12(OUT7)
Net-(R113-1): R113.1 U53.11(OUT8)
Net-(U7-3): U7.3(ДСС) U8.VCC(1)
Net-(U7-5): U7.5(ДМС) U10.VCC(1)
Net-(U7-6): U7.6(ДУН) U11.VCC(1)
Net-(U13-1): U13.1(+8В) U21.VCC(1)
Net-(U13-7): U13.7(Сигнал скорости) U20.VCC(1)
Net-(U13-8): U13.8(Сигнал импульсов) U19.VCC(1)
Net-(U15-5): U15.5(Упр-е нагрузкой) U17.VCC(1)
Net-(U16-8): U16.8(Малая скорость) U18.VCC(1)
Net-(U27-V+): U27.V+(5) U33.1(IP+)
Net-(U37-9): U37.9(Q′H) U38.14(SER)
Net-(U38-9): U38.9(Q′H) U39.14(SER)
Net-(U39-9): U39.9(Q′H) U40.14(SER)
Net-(U40-9): U40.9(Q′H) U44.14(SER)

Not connected (* = marked no-connect by the designer): ?#1 1(VCC) 2(GND) 7(INT) 8(CANL) 9(CANH); ?#2 1(VCC) 2(GND) 7(INT) 8(CANL) 9(CANH); ?#3 3(5V) 4(GND) 5(Can_H) 6(Can_L); ?#4 GND(3) L(1) N(2); ?#7 GND(3) L(1) N(2); ?#8 GND(3) L(1) N(2); Q8 2(C) 3(E); U1 1 2 3 4 5 6 7 8 9 10(MH1) 11(MH2); U2 1 3 4 5 6 8 9 10(MH1) 11(MH2); U3 1(EN) 2(ADC/D36*) 3(ADC/D39*) 4(ADC/D34*) 5(ADC/D35*) 6(ADC/D32) 7(ADC/D33) 8(ADC/DAC0/D25) 9(ADC/DAC1/D26) 10(ADC/D27) 11(ADC/D14) 12(ADC/D12) 13(ADC/D13) 14(GND) 15(VIN) 16(D23) 17(D22) 18(UA0TX/D1) 19(UA0RX/D3) 20(D21) 21(D19) 22(D18) 23(D5) 24(UA2TX/D17) 25(UA2RX/D16) 26(ADC/D4) 27(LED0/D2) 28(ADC/D15) 29(GND) 30(3V3); U4 1(EN) 2(ADC/D36*) 3(ADC/D39*) 4(ADC/D34*) 5(ADC/D35*) 11(ADC/D14) 16(D23) 17(D22) 18(UA0TX/D1) 19(UA0RX/D3) 20(D21) 24(UA2TX/D17) 25(UA2RX/D16) 26(ADC/D4) 27(LED0/D2) 28(ADC/D15) 29(GND) 30(3V3); U6 1(EN) 2(ADC/D36*) 3(ADC/D39*) 4(ADC/D34*) 5(ADC/D35*) 18(UA0TX/D1) 23(D5) 24(UA2TX/D17) 25(UA2RX/D16) 26(ADC/D4) 27(LED0/D2) 28(ADC/D15) 29(GND) 30(3V3); U7 4(ДПР); U9 VCC(1); U12 2(Подсветка) 4(CANH) 5(Резерв) 6("-" АКБ) 7(CAN_GND) 8(CANL); U13 2(GND) 3(Спидометр) 4(Резерв) 5(Резерв) 6(Резерв); U14 1(CANH) 2(CANL) 3(CAN_GND) 4(CAN_T) 5(Резерв) 6(Резерв) 7(Резерв) 8(Резерв); U22 1(EN) 2(ADC/D36*) 3(ADC/D39*) 4(ADC/D34*) 5(ADC/D35*) 8(ADC/DAC0/D25) 18(UA0TX/D1) 22(D18) 23(D5) 24(UA2TX/D17) 25(UA2RX/D16) 26(ADC/D4) 27(LED0/D2) 28(ADC/D15) 29(GND) 30(3V3); U27 GND(3) L(1) N(2); U28 4(CANH) 5(Резерв) 6("-" АКБ) 7(CAN_GND) 8(CANL); U29 2(GND) 4(Резерв) 5(Резерв) 6(Резерв); U30 1(CANH) 2(CANL) 3(CAN_GND) 4(CAN_T) 5(Резерв) 6(Резерв) 7(Резерв) 8(Резерв); U34 2(Резерв); U35 12(Резерв) 13(Резерв); U36 1(CAN_L3) 3(CAN_H3) 5(CAN_GND3) 6(CAN_GND2) 7(CAN_L2) 9(CAN_H2); U42 3(-) 5(-); U44 9(Q′H)*; U54 7(IN7) 8(IN8) 11(OUT8) 12(OUT7)

## Notes on the sheets
sheet 1
- Расстояние между рядами - 25,4 мм
- При использовании
  модуля HW-021 и
  встроенного интерфейса
- При использовании
  модуля MCP2515 и
  интерфейса ESP32V
- При использовании
  модуля MCP2515 и
  интерфейса ESP32H
- Схема подключения к DB9F
  SAE J1939
  250kBPs,16MHz
sheet 2
- Блок питания
  SPV-150-48
- Управление АКБ
  и измерение силы тока
- 1..5.5В
- ДУН - датчик управления нагрузкой
  ДМС - датчик малой скорости
  ДПР - датчик пройденного расстояния
  ДСС - датчик сигнала скорости
- Управление зажиганием
- Управление зажиганием
- Блок питания
  для ESP32
- Измерение напряжения
  блока питания
  делитель 48В-3.3В
- Блок питания
  SPV-150-48
- 1..5.5В
- 0..48В
- Делитель
  напряжения 48В/24В
- Измерение тока щитка
  (до 25В, 5А)
sheet 3
- Блок питания
  SPV-150-48
- Измерение силы тока
- 1..5.5В
- Управление АКБ
- Измерение напряжения
  блока питания
  делитель 48В-3.3В
- Делитель 24В-10В
- Делитель 24В-10В
- Управление подсветкой
- Управление зажиганием
- Блок питания
  для ESP32
- Сигнал скорости
- Делители напряжения
  10В/3.3В
sheet 4
- Магазин сопротивлений (72 резистора)
- 50V
  0,5A
- 50V
  0,5A
- 50V
  0,5A
- Блок питания
  SPV-150-24
- Измерение силы тока
- 1..5.5В
- Питание "+12В" после выкл. АКБ
- 50V
  0,5A
- 50V
  0,5A
- 50V
  0,5A
- Измерение напряжения
  блока питания
  делитель 24В-3.3В
- Делитель 24В-12В
- Питание "+12В" от АКБ
- Питание "+12В" после выкл. стартера
- 50V
  0,5A
- 50V
  0,5A
- 50V
  0,5A
- 50V
  0,5A
- 50V
  0,5A
- Задатчик частотных сигналов
- Делители напряжения
  12В/3.3В
- 50V
  0,5A
- Блок питания
  для ESP32
- 2..6V
  70mA
